# EAGLE board BPB_FM1 (EAGLE 9.6.2), part 1 of 2
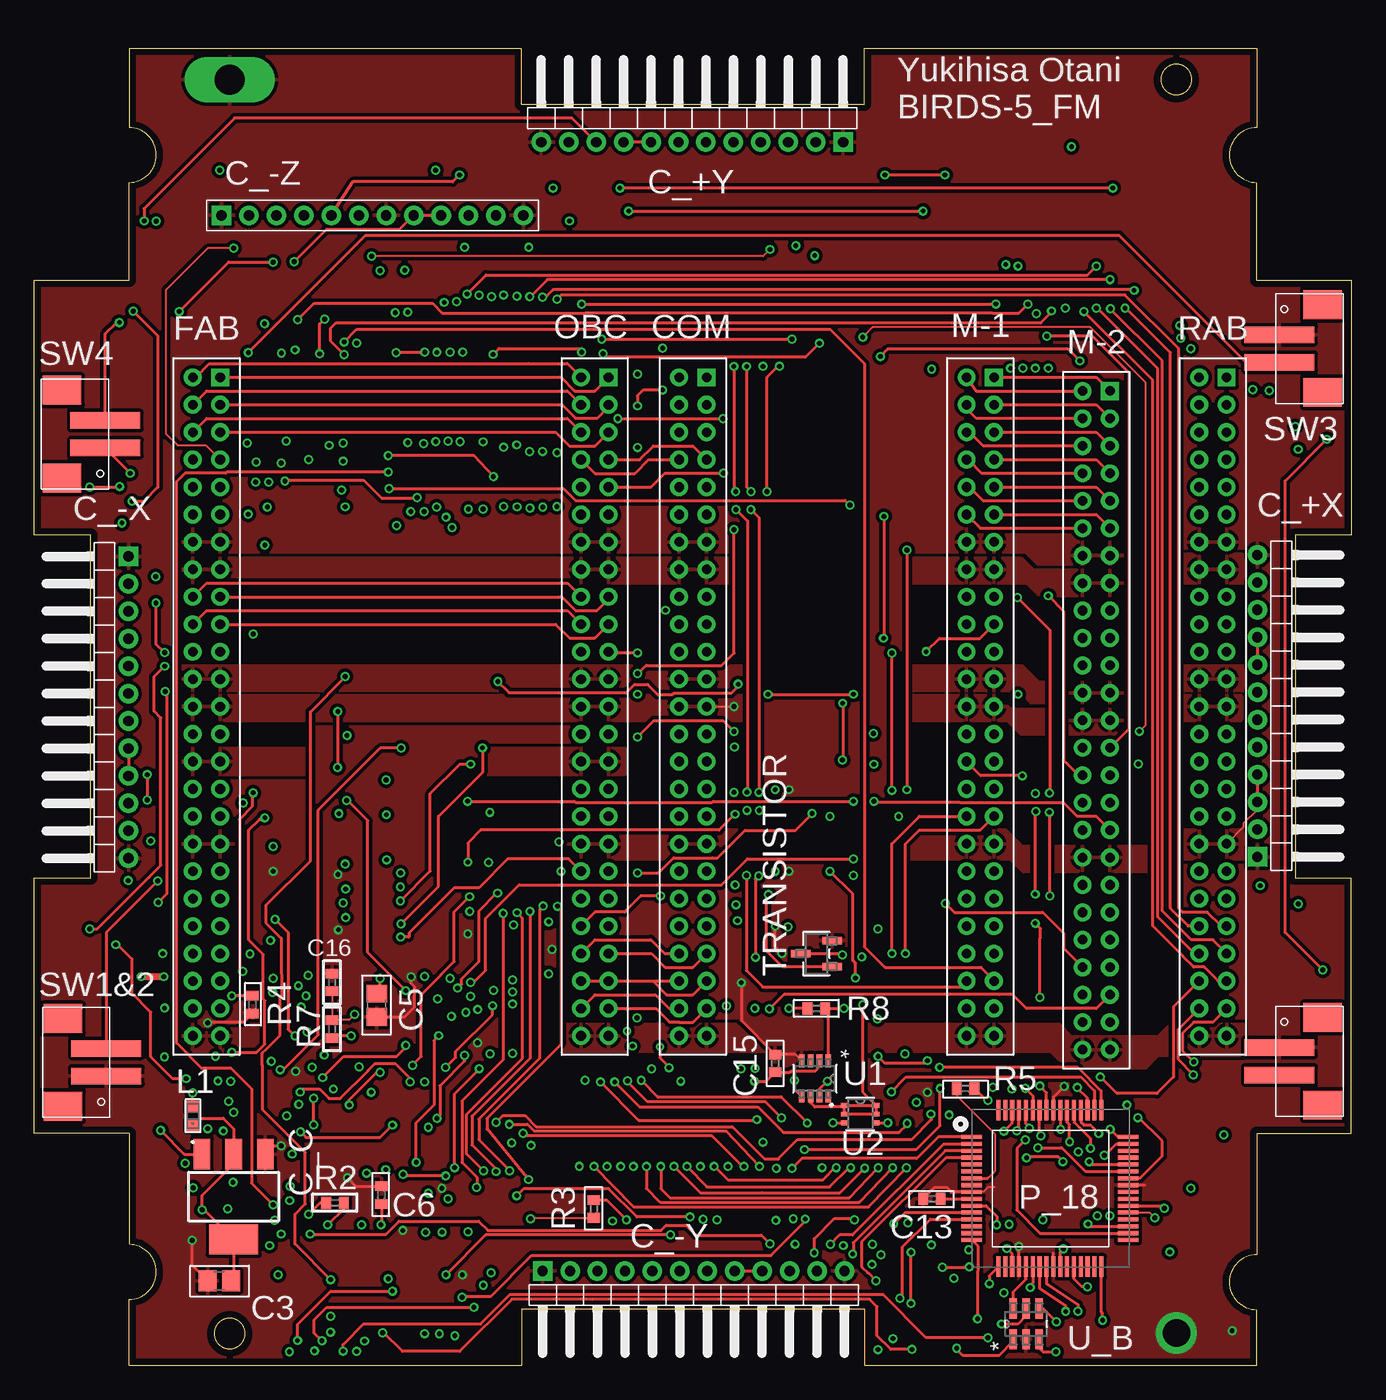
[diagram p2: board, top side]
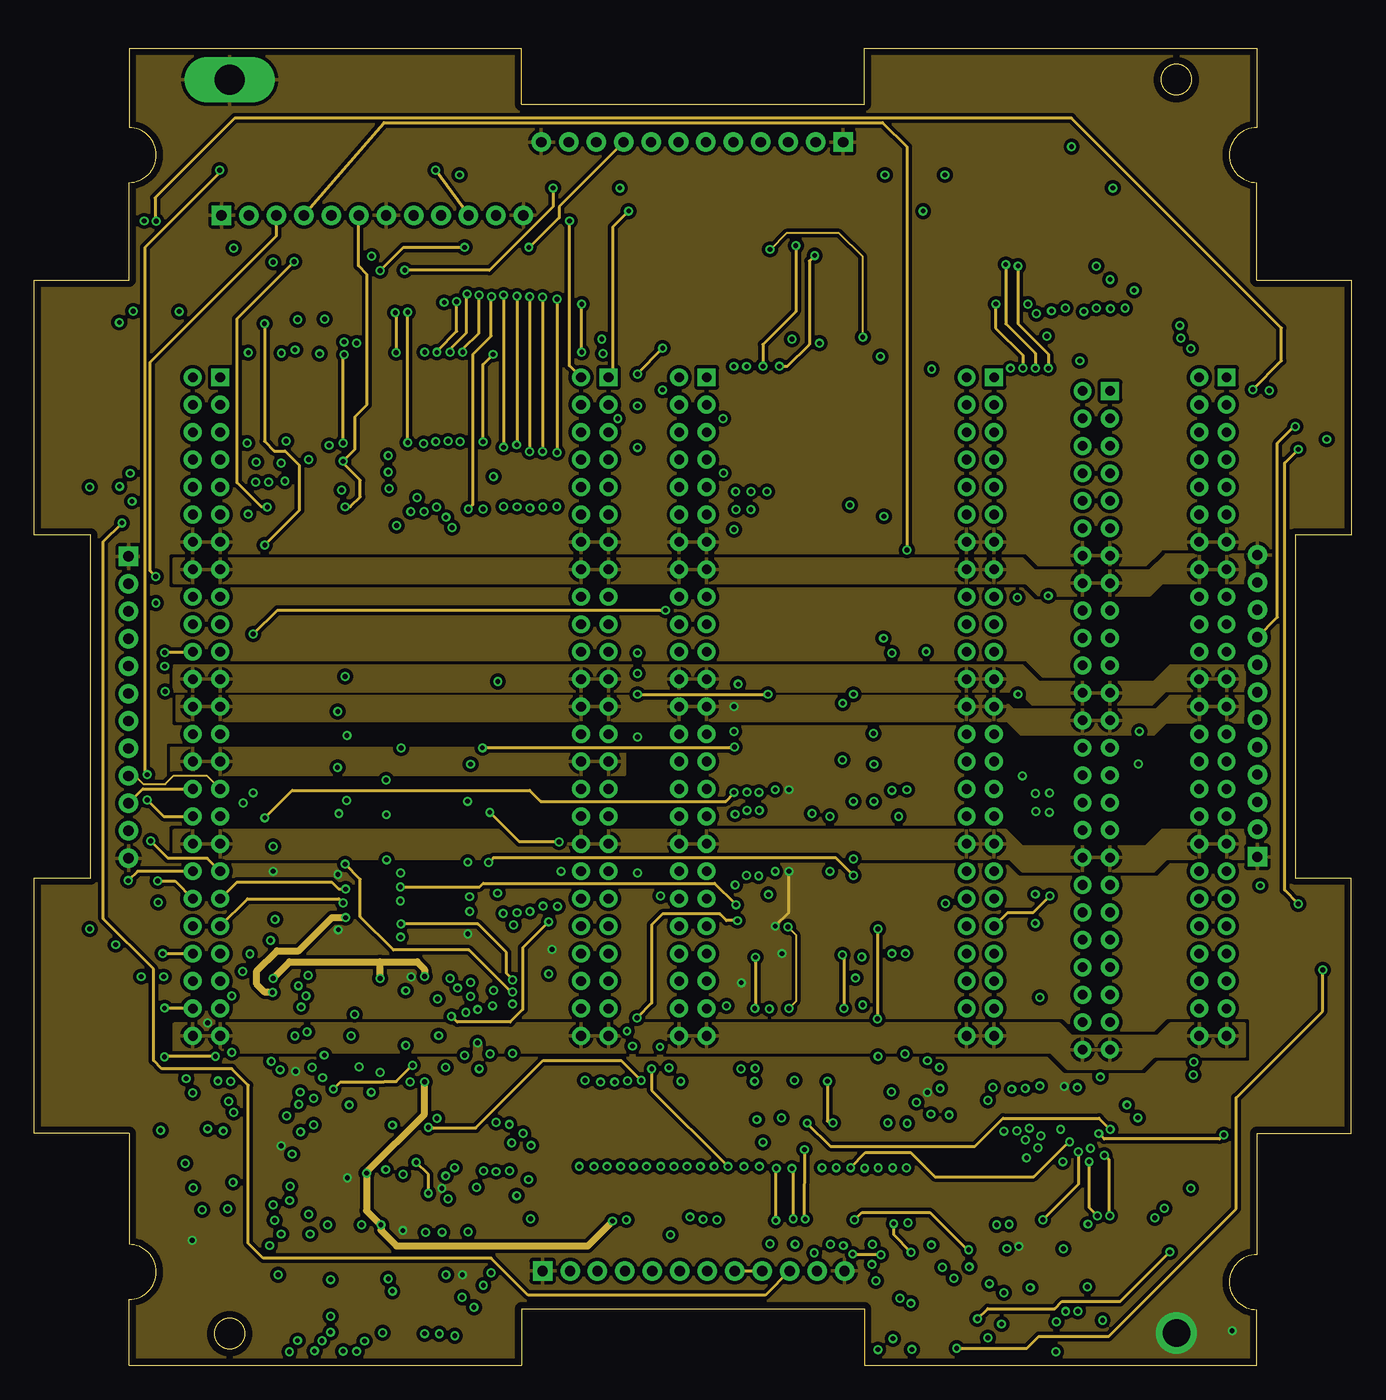
[diagram p3: board, inner layer Power1]
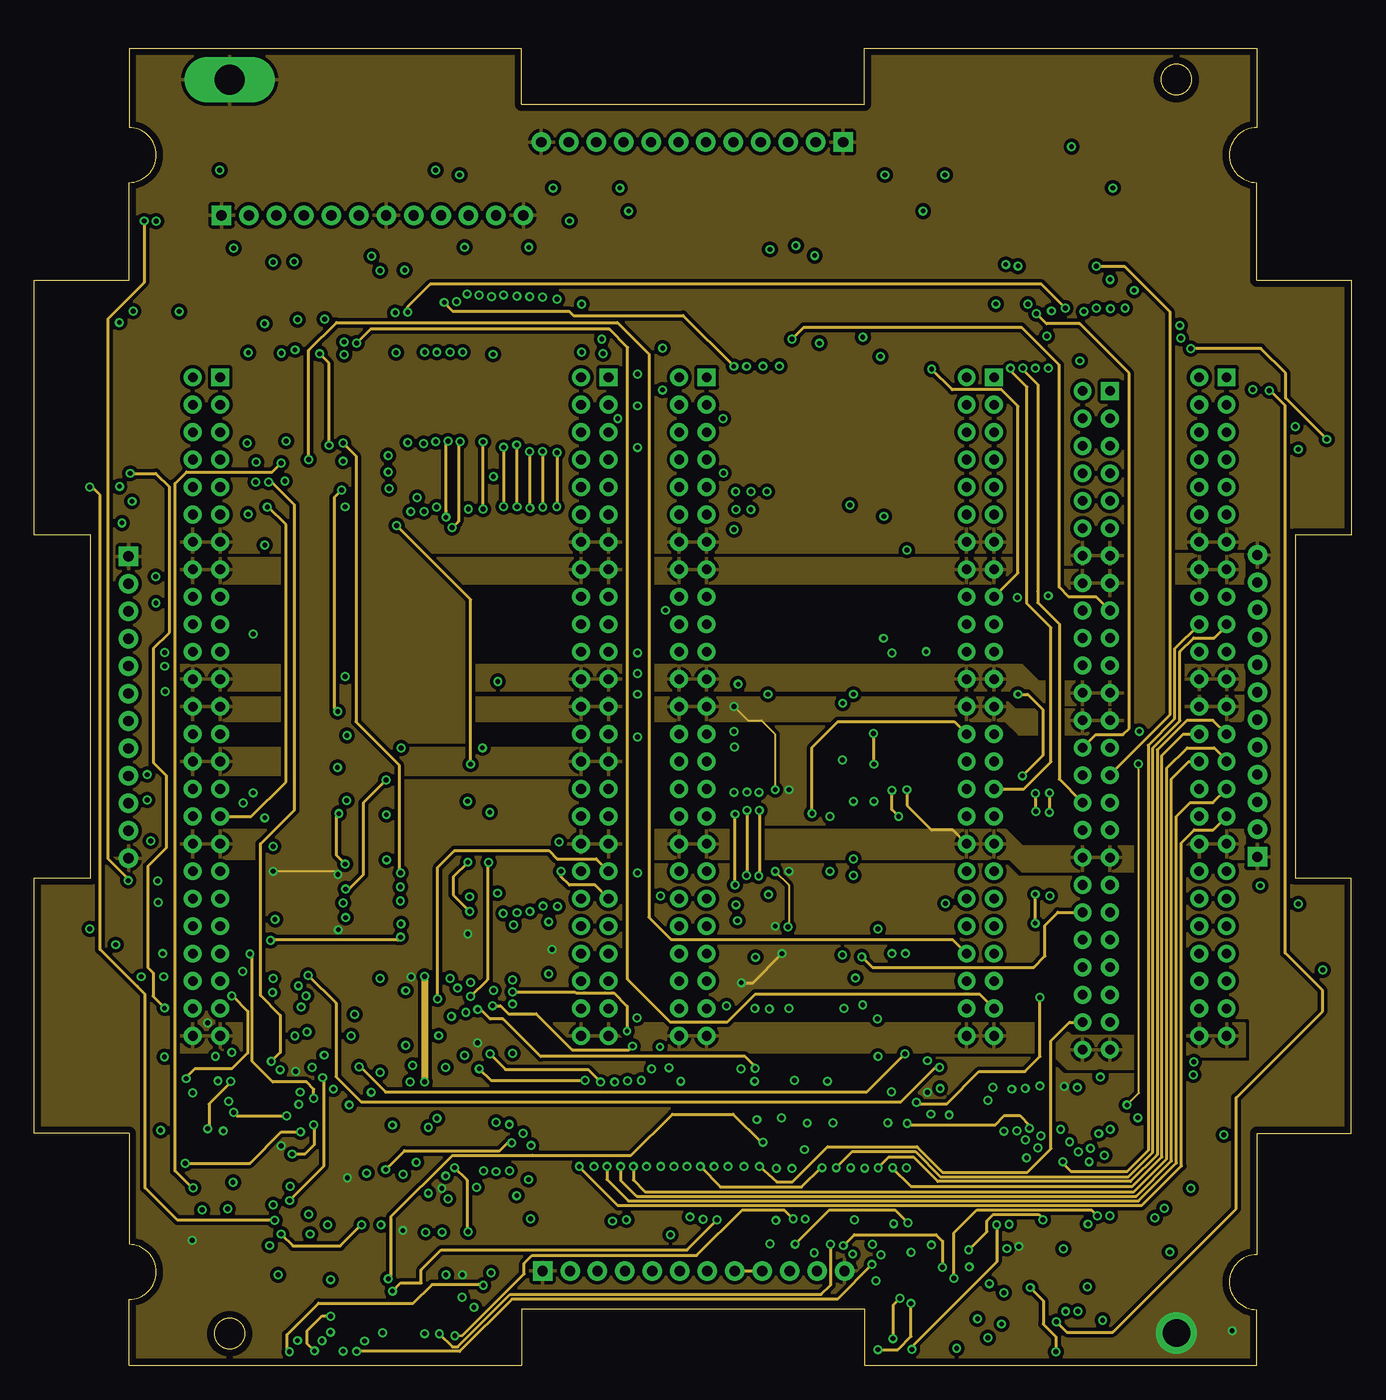
[diagram p4: board, inner layer Route3]
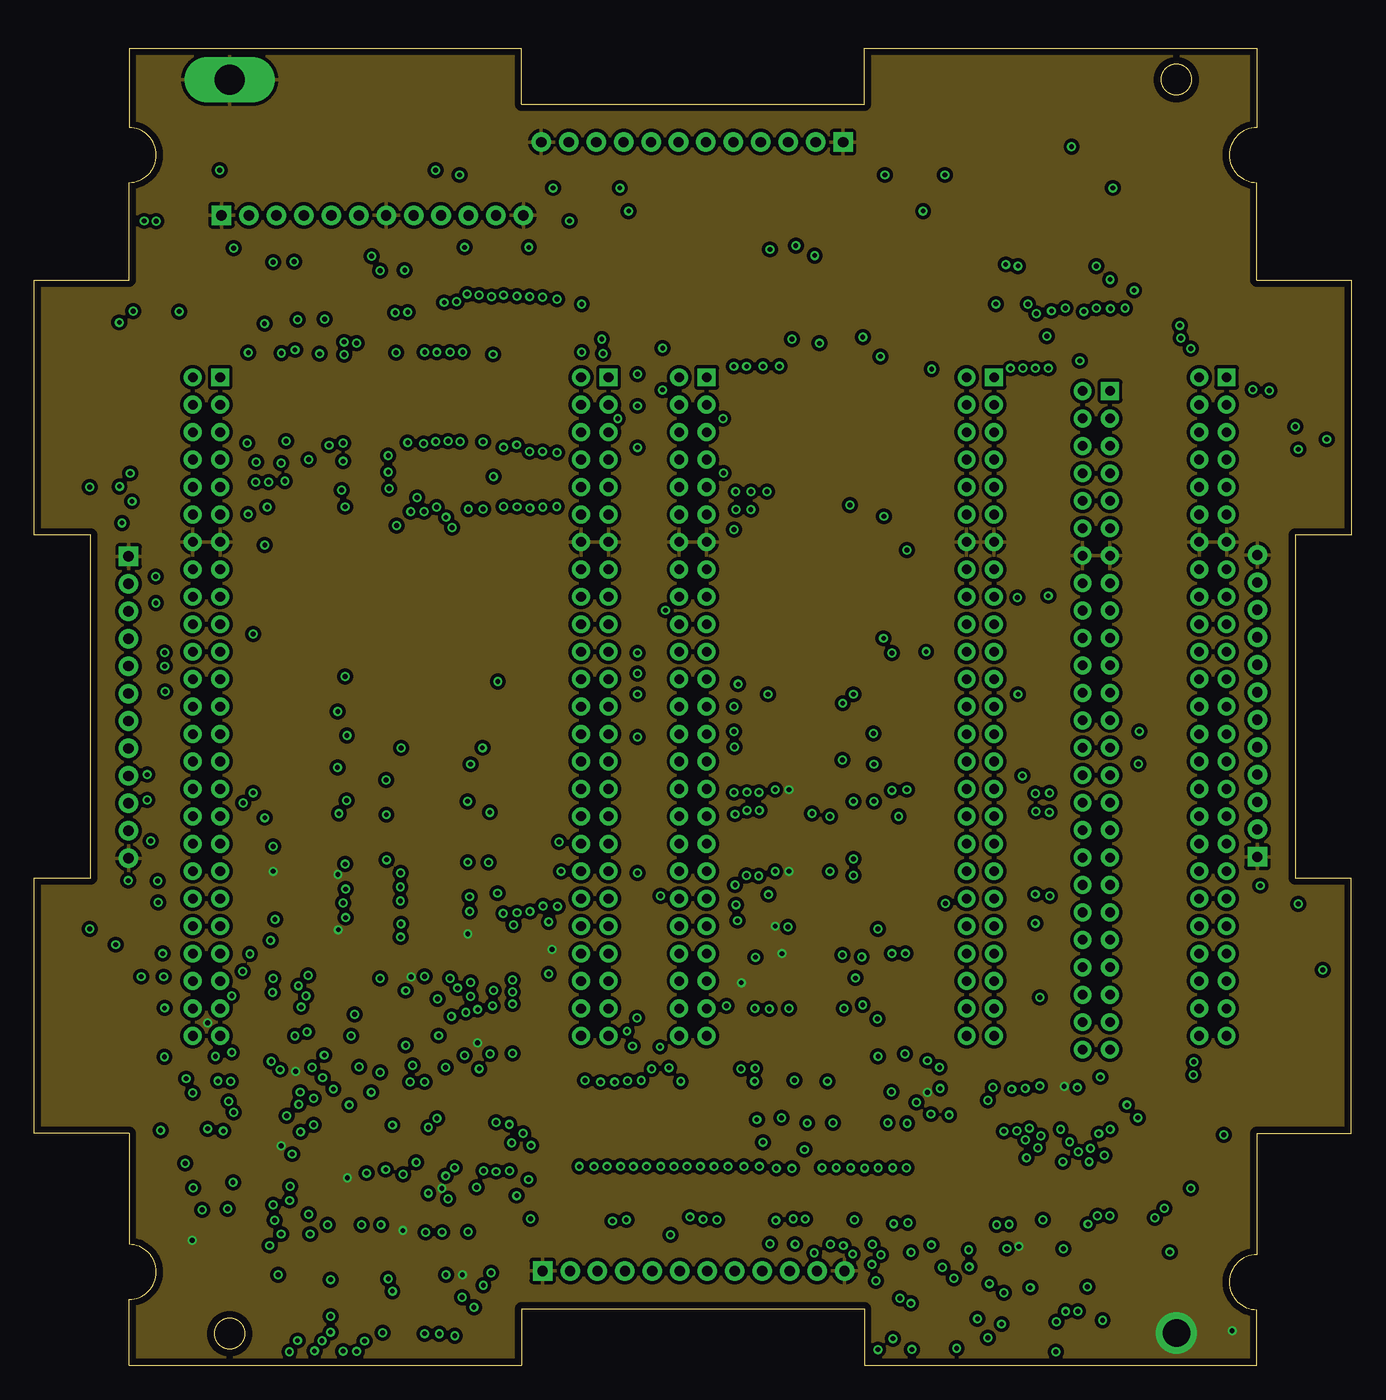
[diagram p5: board, inner layer Route4]
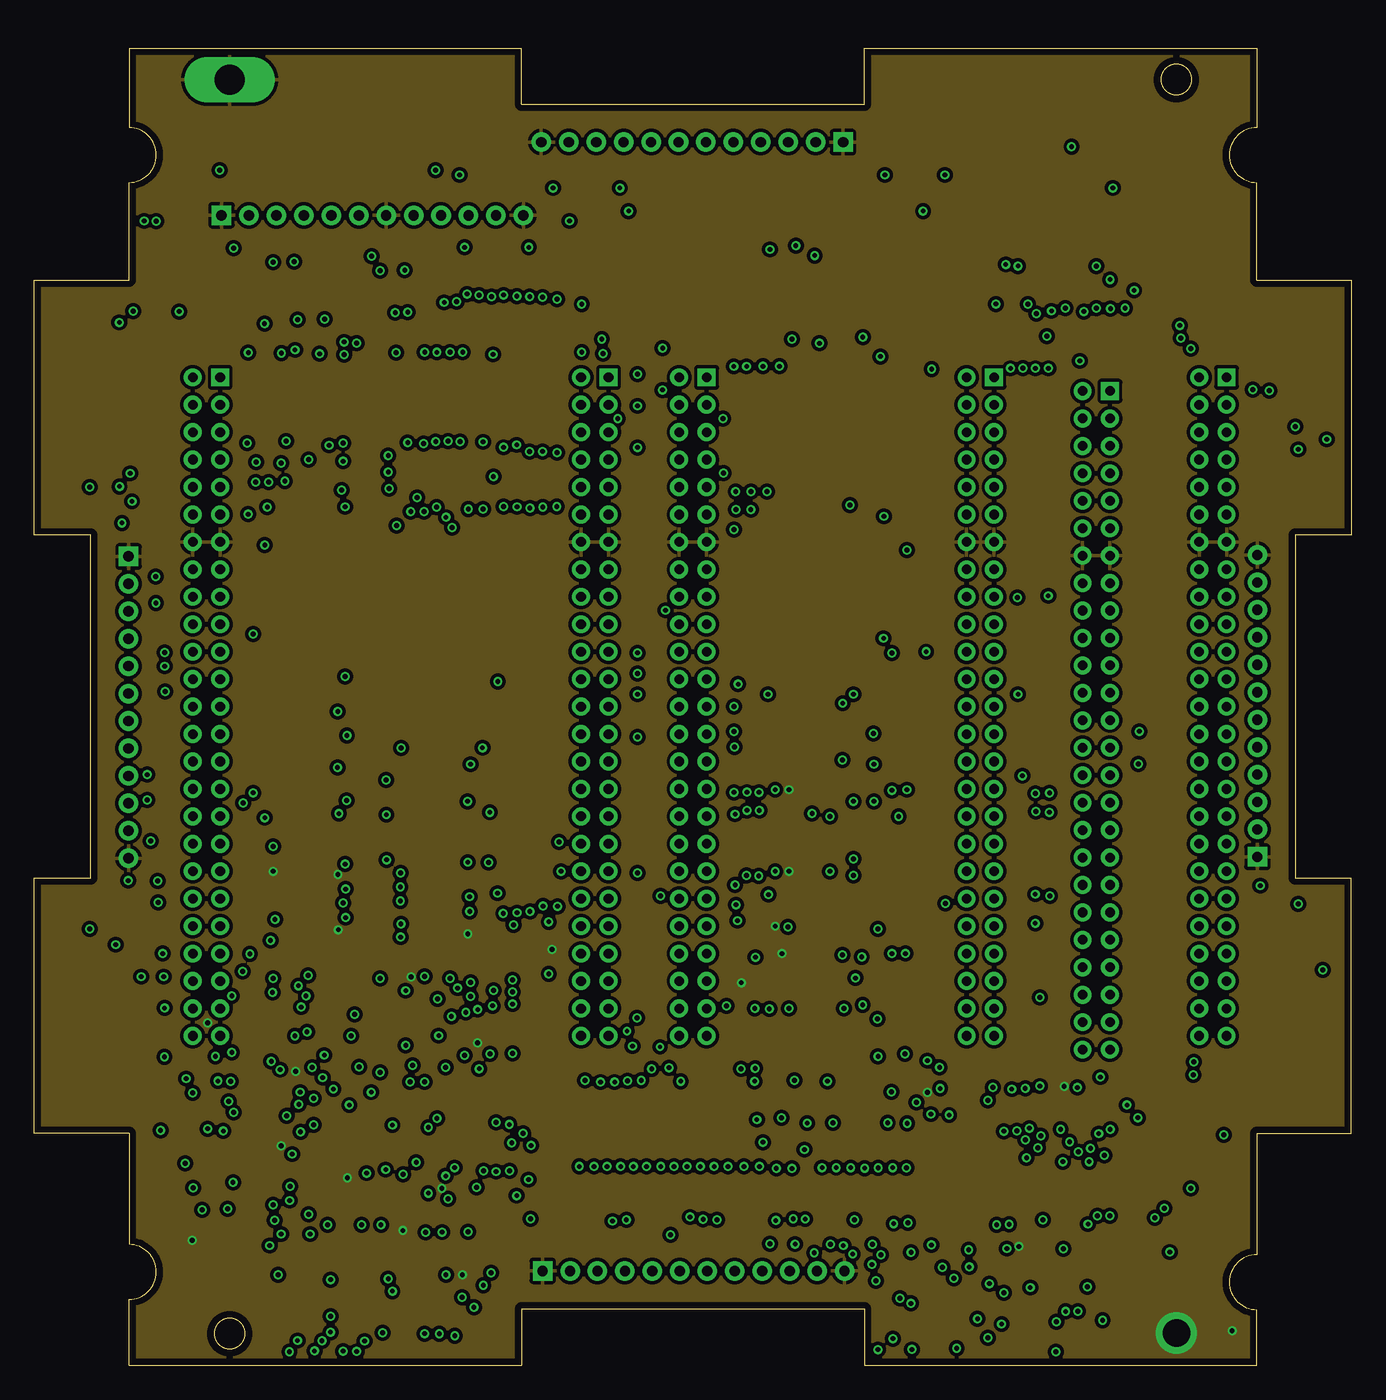
[diagram p6: board, inner layer Route13]
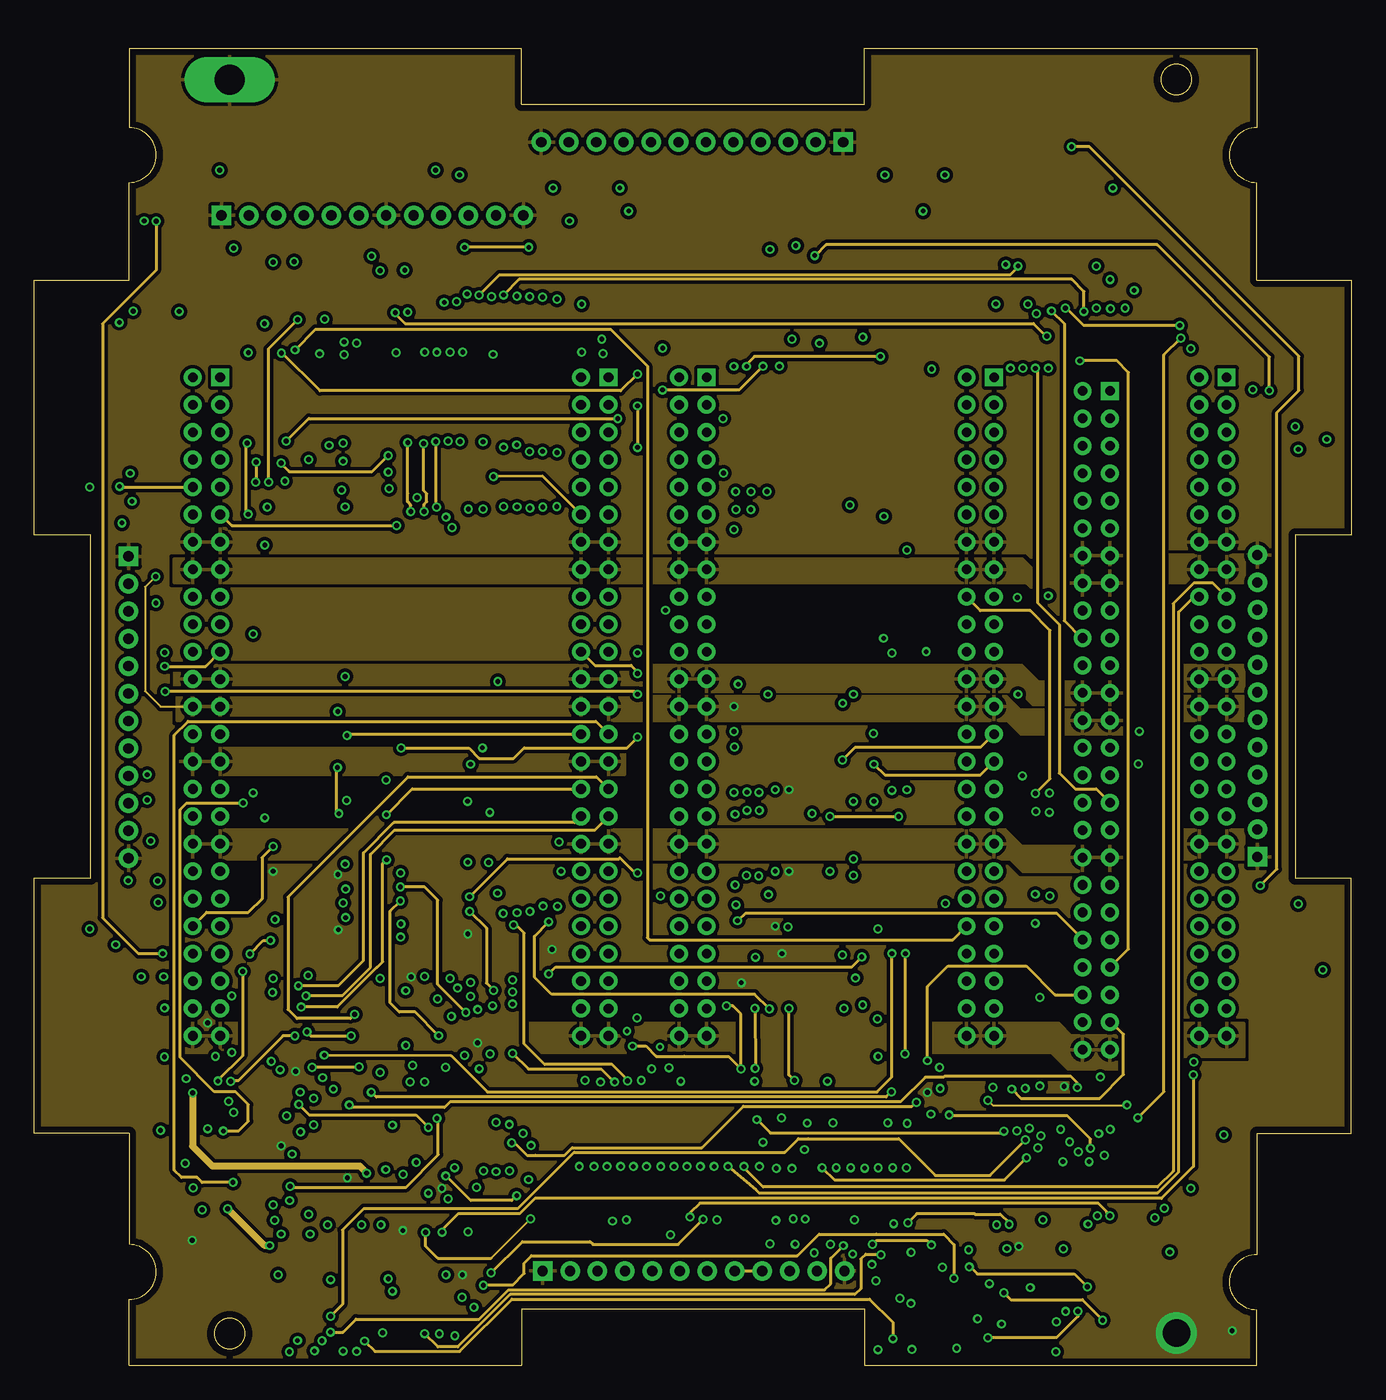
[diagram p7: board, inner layer Route14]
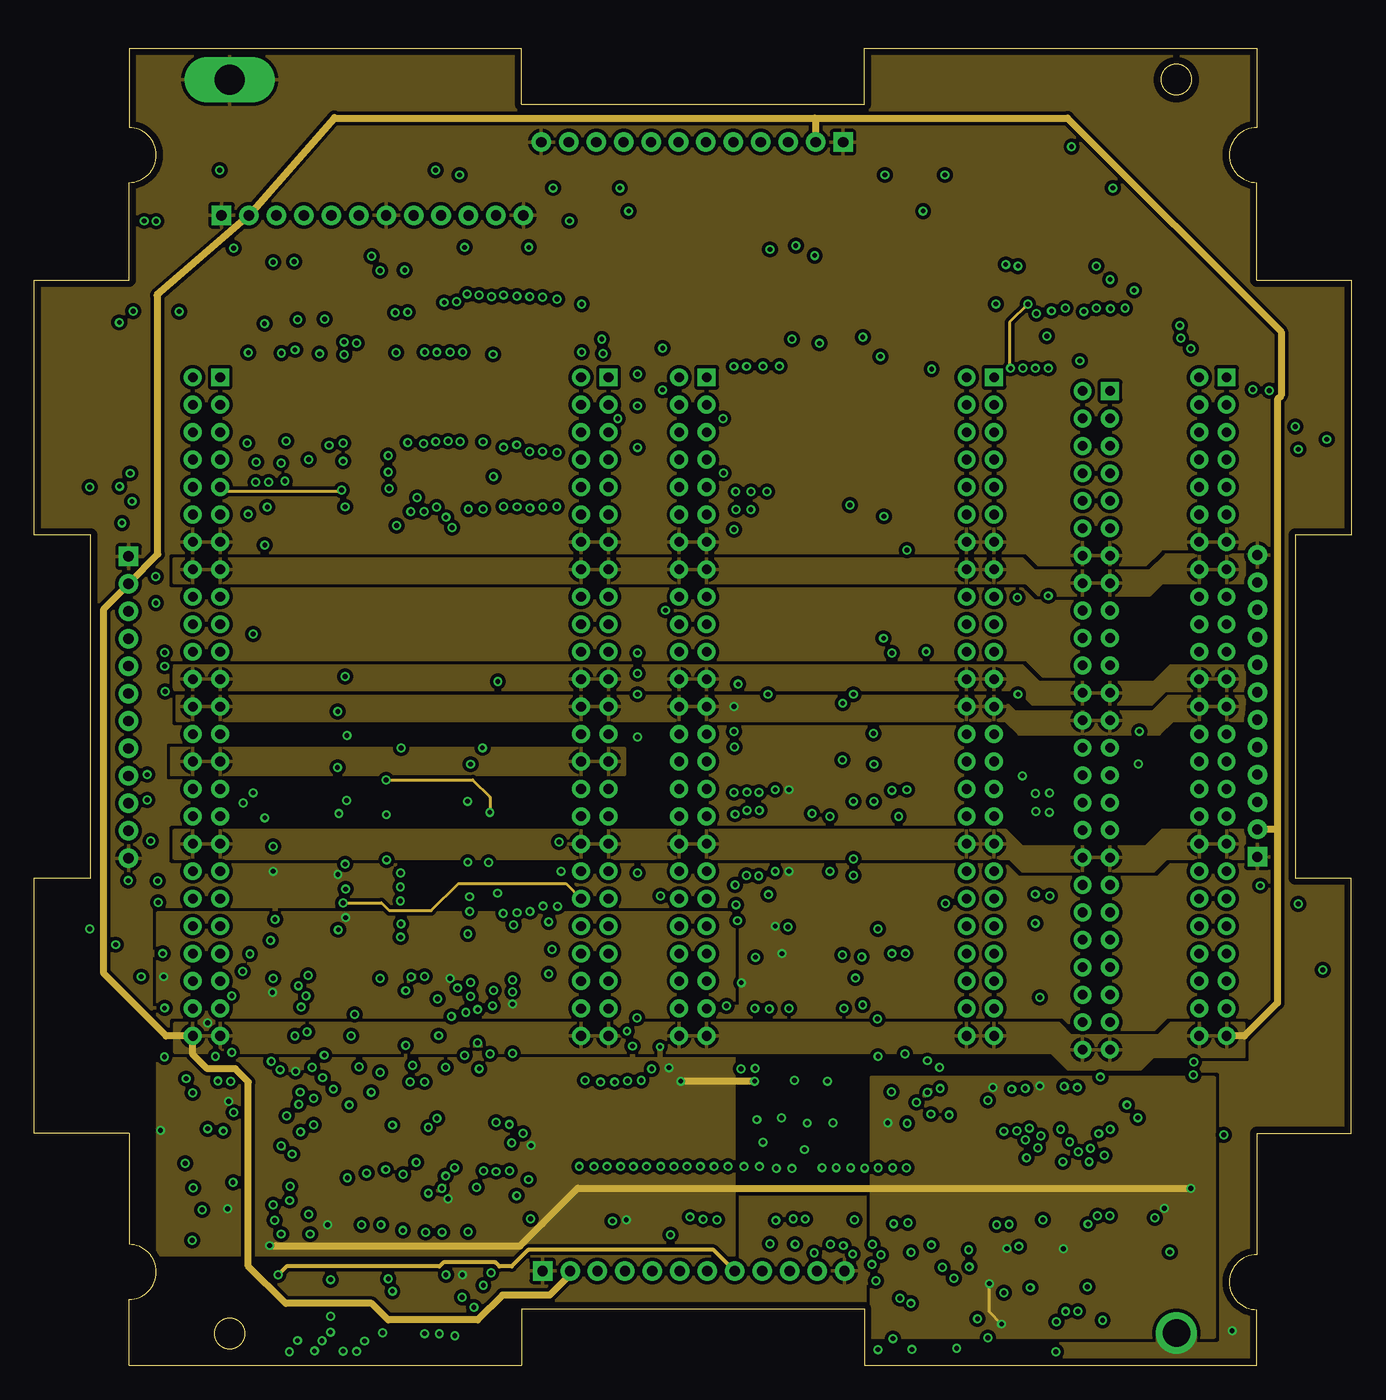
[diagram p8: board, inner layer Power2]
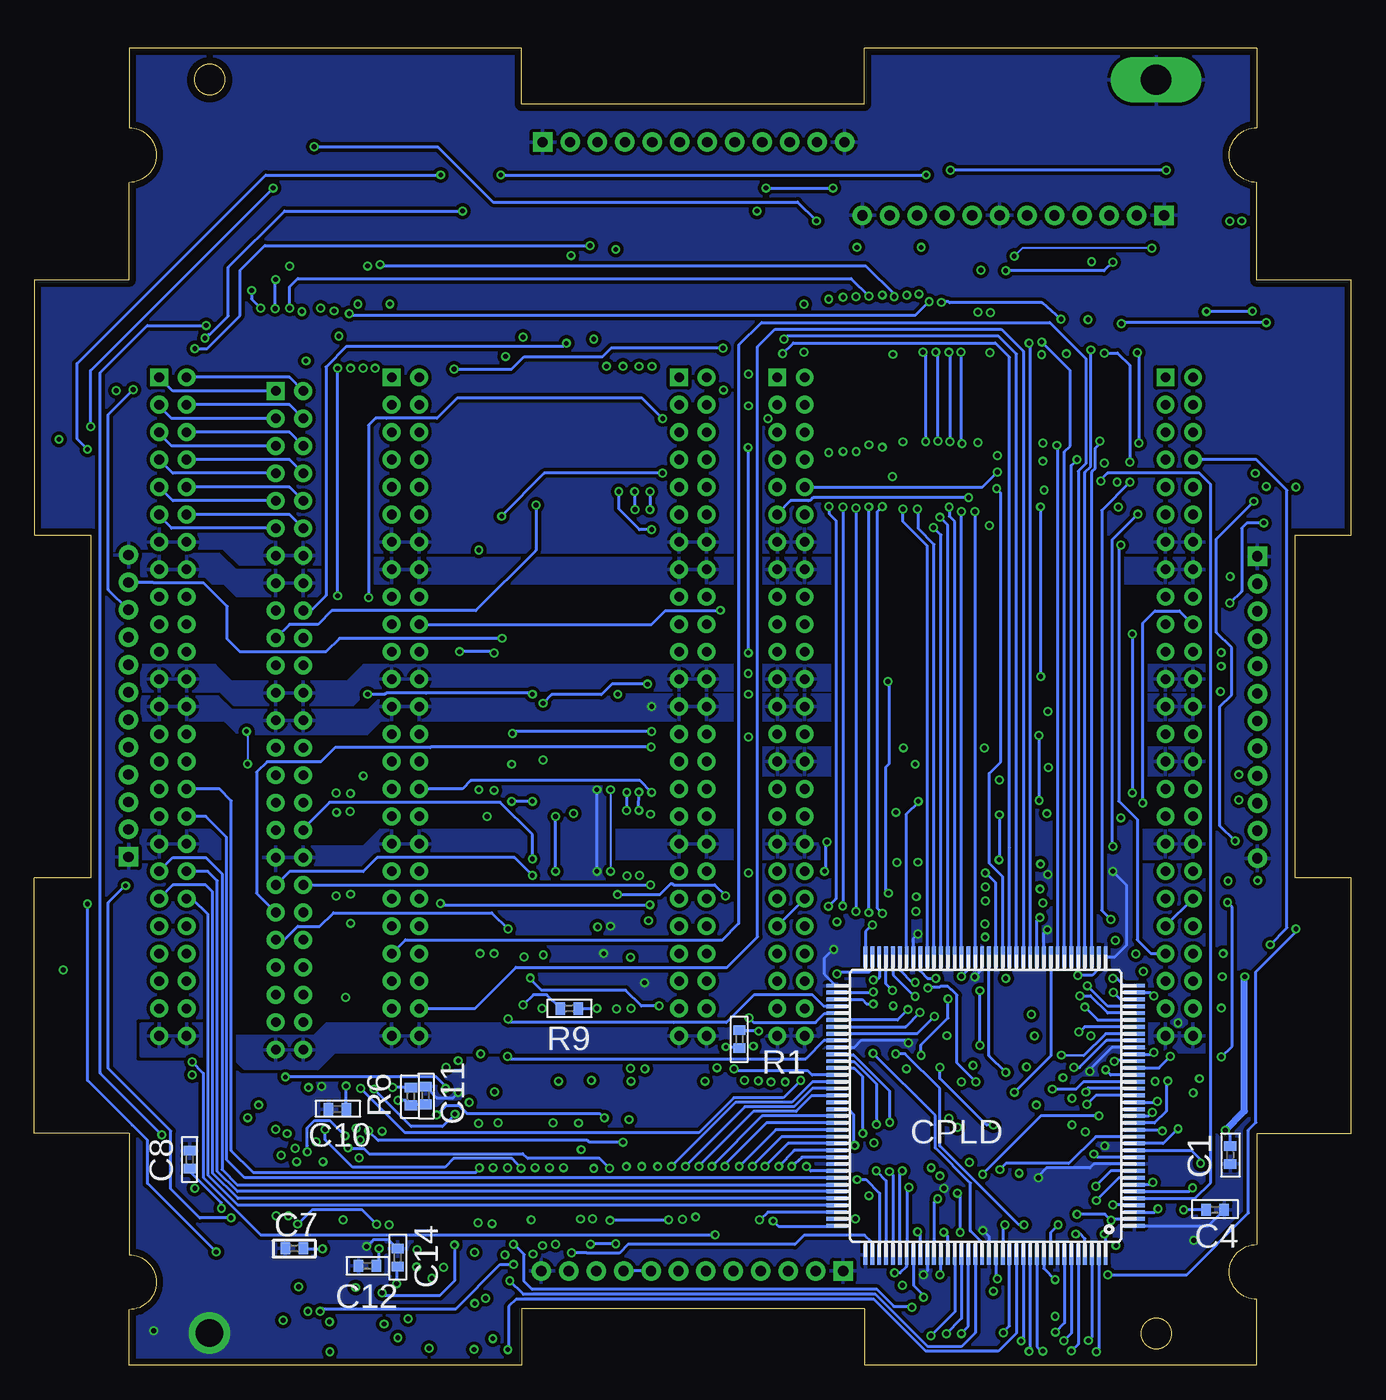
[diagram p9: board, bottom side, seen from below]

Size 96 x 96 mm. Coordinates in mm from the lower left corner, seen from the top.
Outline: 6.9,16.9 0,16.9 0,35.5 4.1,35.5 4.1,60.5 0,60.5 0,79.1 6.9,79.1 6.9,86.2 arc180 6.9,90.2 6.9,96 35.5,96 35.5,91.9 60.5,91.9 60.5,96 89.1,96 89.1,90.2 arc180 89.1,86.2 89.1,79.1 96,79.1 96,60.5 91.9,60.5 91.9,35.5 96,35.5 96,16.9 89.1,16.9 89.1,8.05 arc180 89.1,4.05 89.1,0 60.5,0 60.5,4.1 35.5,4.1 35.5,0 6.9,0 6.9,4.8 arc180 6.9,8.8 6.9,16.9
Outline: circle at 14.23,2.3 radius 1.1
Outline: circle at 83.23,93.71 radius 1.1
Copper layers (1+(2*3)+(14*15)+16): Top 0.018mm / dielectric 0.2mm / Power1 0.035mm / dielectric 0.4mm / Route3 0.035mm / dielectric 0.2mm / Route14 0.035mm / dielectric 0.4mm / Power2 0.035mm / dielectric 0.2mm / Bottom 0.018mm
Design rules "pban_5mil-l6_CURTIS": minimum track width 5mil, minimum drill 0.3mm, track to track 5mil, track to pad 0.229mm, pad to pad 5mil, via to via 5mil, smd to smd 5mil, copper to edge 0.5mm, drill to drill 0.5mm, minimum pad ring 0.15mm, minimum via ring 0.15mm, stop-mask expansion 0.05mm, vias tented up to drill 0.35mm, thermal gap 10mil
Net classes: 3 SUP_UNREG: width 1.27 mm

## Footprints (pad centres in the part's own frame; a part is rotated, then mirrored left to right if it is on the bottom)
C0402 = smd 0.7 x 0.9: 1 -0.65,0; 2 0.65,0
C2012 = smd 1.3 x 1.5: 1 -0.85,0; 2 0.85,0
PIN1X12/90 = drill 0.75 pad 1.422 square: 1 -0.048,-0.063 | drill 0.75 pad 1.422: 2 -2.048,-0.063; 3 -4.048,-0.063; 4 -6.048,-0.063; 5 -8.048,-0.063; 6 -10.048,-0.063; 7 -12.048,-0.063; 8 -14.048,-0.063; 9 -16.048,-0.063; 10 -18.048,-0.063; 11 -20.048,-0.063; 12 -22.048,-0.063
PIN1X12 = drill 0.75 pad 1.422 square: 1 -0.048,-0.063 | drill 0.75 pad 1.422: 2 -2.048,-0.063; 3 -4.048,-0.063; 4 -6.048,-0.063; 5 -8.048,-0.063; 6 -10.048,-0.063; 7 -12.048,-0.063; 8 -14.048,-0.063; 9 -16.048,-0.063; 10 -18.048,-0.063; 11 -20.048,-0.063; 12 -22.048,-0.063
SOT223 = smd 1.219 x 2.235: 1 -2.311,-3.099; 2 0,-3.099; 3 2.311,-3.099 | smd 3.6 x 2.2: 4 0,3.099
SHDR50W60P200_2X25_5000X400X44_TR = drill 0.7 pad 1.3 square: P$1 0,2 | drill 0.7 pad 1.3: P$2 0,0; P$3 2,2; P$4 2,0; P$5 4,2; P$6 4,0; P$7 6,2; P$8 6,0; P$9 8,2; P$10 8,0; P$11 10,2; P$12 10,0; P$13 12,2; P$14 12,0; P$15 14,2; P$16 14,0; P$17 16,2; P$18 16,0; P$19 18,2; P$20 18,0; P$21 20,2; P$22 20,0; P$23 22,2; P$24 22,0; P$25 24,2; P$26 24,0; P$27 26,2; P$28 26,0; P$29 28,2; P$30 28,0; P$31 30,2; P$32 30,0; P$33 32,2; P$34 32,0; P$35 34,2; P$36 34,0; P$37 36,2; P$38 36,0; P$39 38,2; P$40 38,0; P$41 40,2; P$42 40,0; P$43 42,2; P$44 42,0; P$45 44,2; P$46 44,0; P$47 46,2; P$48 46,0; P$49 48,2; P$50 48,0
TQFP144 = smd 1.5 x 0.285: 1 -10.85,8.75; 2 -10.85,8.25; 3 -10.85,7.75; 4 -10.85,7.25; 5 -10.85,6.75; 6 -10.85,6.25; 7 -10.85,5.75; 8 -10.85,5.25; 9 -10.85,4.75; 10 -10.85,4.25; 11 -10.85,3.75; 12 -10.85,3.25; 13 -10.85,2.75; 14 -10.85,2.25; 15 -10.85,1.75; 16 -10.85,1.25; 17 -10.85,0.75; 18 -10.85,0.25; 19 -10.85,-0.25; 20 -10.85,-0.75; 21 -10.85,-1.25; 22 -10.85,-1.75; 23 -10.85,-2.25; 24 -10.85,-2.75; 25 -10.85,-3.25; 26 -10.85,-3.75; 27 -10.85,-4.25; 28 -10.85,-4.75; 29 -10.85,-5.25; 30 -10.85,-5.75; 31 -10.85,-6.25; 32 -10.85,-6.75; 33 -10.85,-7.25; 34 -10.85,-7.75; 35 -10.85,-8.25; 36 -10.85,-8.75; 73 10.85,-8.75; 74 10.85,-8.25; 75 10.85,-7.75; 76 10.85,-7.25; 77 10.85,-6.75; 78 10.85,-6.25; 79 10.85,-5.75; 80 10.85,-5.25; 81 10.85,-4.75; 82 10.85,-4.25; 83 10.85,-3.75; 84 10.85,-3.25; 85 10.85,-2.75; 86 10.85,-2.25; 87 10.85,-1.75; 88 10.85,-1.25; 89 10.85,-0.75; 90 10.85,-0.25; 91 10.85,0.25; 92 10.85,0.75; 93 10.85,1.25; 94 10.85,1.75; 95 10.85,2.25; 96 10.85,2.75; 97 10.85,3.25; 98 10.85,3.75; 99 10.85,4.25; 100 10.85,4.75; 101 10.85,5.25; 102 10.85,5.75; 103 10.85,6.25; 104 10.85,6.75; 105 10.85,7.25; 106 10.85,7.75; 107 10.85,8.25; 108 10.85,8.75 | smd 0.285 x 1.5: 37 -8.75,-10.85; 38 -8.25,-10.85; 39 -7.75,-10.85; 40 -7.25,-10.85; 41 -6.75,-10.85; 42 -6.25,-10.85; 43 -5.75,-10.85; 44 -5.25,-10.85; 45 -4.75,-10.85; 46 -4.25,-10.85; 47 -3.75,-10.85; 48 -3.25,-10.85; 49 -2.75,-10.85; 50 -2.25,-10.85; 51 -1.75,-10.85; 52 -1.25,-10.85; 53 -0.75,-10.85; 54 -0.25,-10.85; 55 0.25,-10.85; 56 0.75,-10.85; 57 1.25,-10.85; 58 1.75,-10.85; 59 2.25,-10.85; 60 2.75,-10.85; 61 3.25,-10.85; 62 3.75,-10.85; 63 4.25,-10.85; 64 4.75,-10.85; 65 5.25,-10.85; 66 5.75,-10.85; 67 6.25,-10.85; 68 6.75,-10.85; 69 7.25,-10.85; 70 7.75,-10.85; 71 8.25,-10.85; 72 8.75,-10.85; 109 8.75,10.85; 110 8.25,10.85; 111 7.75,10.85; 112 7.25,10.85; 113 6.75,10.85; 114 6.25,10.85; 115 5.75,10.85; 116 5.25,10.85; 117 4.75,10.85; 118 4.25,10.85; 119 3.75,10.85; 120 3.25,10.85; 121 2.75,10.85; 122 2.25,10.85; 123 1.75,10.85; 124 1.25,10.85; 125 0.75,10.85; 126 0.25,10.85; 127 -0.25,10.85; 128 -0.75,10.85; 129 -1.25,10.85; 130 -1.75,10.85; 131 -2.25,10.85; 132 -2.75,10.85; 133 -3.25,10.85; 134 -3.75,10.85; 135 -4.25,10.85; 136 -4.75,10.85; 137 -5.25,10.85; 138 -5.75,10.85; 139 -6.25,10.85; 140 -6.75,10.85; 141 -7.25,10.85; 142 -7.75,10.85; 143 -8.25,10.85; 144 -8.75,10.85
TURO_COLLECTION_IND_BLM18_0603 = smd 0.813 x 0.94: 1 -0.673,0; 2 0.673,0
PIC18F67J9_SMA_LEAD = smd 1.5 x 0.3: 1 0,0; 2 0,-0.5; 3 0,-1; 4 0,-1.5; 5 0,-2; 6 0,-2.5; 7 0,-3; 8 0,-3.5; 9 0,-4; 10 0,-4.5; 11 0,-5; 12 0,-5.5; 13 0,-6; 14 0,-6.5; 15 0,-7; 16 0,-7.5; 33 11.4,-7.5; 34 11.4,-7; 35 11.4,-6.5; 36 11.4,-6; 37 11.4,-5.5; 38 11.4,-5; 39 11.4,-4.5; 40 11.4,-4; 41 11.4,-3.5; 42 11.4,-3; 43 11.4,-2.5; 44 11.4,-2; 45 11.4,-1.5; 46 11.4,-1; 47 11.4,-0.5; 48 11.4,0 | smd 0.3 x 1.5: 17 1.95,-9.45; 18 2.45,-9.45; 19 2.95,-9.45; 20 3.45,-9.45; 21 3.95,-9.45; 22 4.45,-9.45; 23 4.95,-9.45; 24 5.45,-9.45; 25 5.95,-9.45; 26 6.45,-9.45; 27 6.95,-9.45; 28 7.45,-9.45; 29 7.95,-9.45; 30 8.45,-9.45; 31 8.95,-9.45; 32 9.45,-9.45; 49 9.45,1.95; 50 8.95,1.95; 51 8.45,1.95; 52 7.95,1.95; 53 7.45,1.95; 54 6.95,1.95; 55 6.45,1.95; 56 5.95,1.95; 57 5.45,1.95; 58 4.95,1.95; 59 4.45,1.95; 60 3.95,1.95; 61 3.45,1.95; 62 2.95,1.95; 63 2.45,1.95; 64 1.95,1.95
R0402 = smd 0.7 x 0.9: 1 -0.65,0; 2 0.65,0
MOLEX-CONN-2-BIRDS = smd 1.2 x 5.1: 1 2.6,2.55; 2 0.6,2.55 | smd 2.1 x 2.8: P$3 -1.6,-0.6; P$4 4.8,-0.6
TRANS_DTA113TKAT_ROM = smd 0.559 x 1.422: 1 -0.95,-1.143; 2 0.95,-1.143; 3 0,1.143
TSOT-23_TS8_LIT = smd 0.876 x 0.406: 1 -1.314,0.975; 2 -1.314,0.325; 3 -1.314,-0.325; 4 -1.314,-0.975; 5 1.314,-0.975; 6 1.314,-0.325; 7 1.314,0.325; 8 1.314,0.975
SON_E85L,F_TOS = smd 0.508 x 0.356: 1 -1.156,0.65; 2 -1.156,0; 3 -1.156,-0.65; 4 1.156,-0.65; 5 1.156,0; 6 1.156,0.65
GND_PAD = drill 2.2 pad 3.3 long: GND_PAD 0,0
DBV6 = smd 1.473 x 0.559: 1 -1.118,0.95; 2 -1.118,0; 3 -1.118,-0.95; 4 1.118,-0.95; 5 1.118,0; 6 1.118,0.95

## Placement (x,y rotation side)
C1  0.1uF  [C0402]  8.84,15.32 270 bottom
C3  22uF  [C2012]  13.49,6.15 180 top
C4  0.1uF  [C0402]  9.94,11.32 0 bottom
C5  4.7uF  [C2012]  24.96,26.23 270 top
C6  0.1uF  [C0402]  25.3,12.4 90 top
C7  0.1uF  [C0402]  77.05,8.52 180 bottom
C8  0.1uF  [C0402]  84.68,14.99 90 bottom
C10  0.1uF  [C0402]  73.91,18.66 180 bottom
C11  0.1uF  [C0402]  67.48,19.66 90 bottom
C12  0.1uF  [C0402]  71.73,7.24 0 bottom
C13  10uF  [C0402]  65.42,12.13 180 top
C14  0.1uF  [C0402]  69.52,7.84 90 bottom
C15  4.7uF  [C0402]  54,22 270 top
C16  100pF  [C0402]  21.7,27.9 90 top
C_+X  PSR-210154-12  [PIN1X12/90]  89.2,37 270 top
C_+Y  PSR-210154-12  [PIN1X12/90]  59,89.2 0 top
C_-X  PSR-210154-12  [PIN1X12/90]  6.8,59 90 top
C_-Y  PSR-210154-12  [PIN1X12/90]  37,6.8 180 top
C_-Z  PSS-210204-12  [PIN1X12]  13.6,83.74 180 top
C_C  NCV1117ST18T3G  [SOT223]  14.53,12.28 180 top
COM  A3C-50DA-2DSA(71)_TUROA3C-50A-2DSA  [SHDR50W60P200_2X25_5000X400X44_TR]  47,72 270 top
CPLD  LC4256ZE_XXTN144  [TQFP144]  26.67,18.91 180 bottom
FAB  A3C-50DA-2DSA(71)_TUROA3C-50A-2DSA  [SHDR50W60P200_2X25_5000X400X44_TR]  11.55,72 270 top
L1  TURO_COLLECTION_BLM18AG601SN1D  [TURO_COLLECTION_IND_BLM18_0603]  11.55,18.17 90 top
M-1  A3C-50DA-2DSA(71)_TUROA3C-50A-2DSA  [SHDR50W60P200_2X25_5000X400X44_TR]  67.95,72 270 top
M-2  A3C-50DA-2DSA(71)_TUROA3C-50A-2DSA  [SHDR50W60P200_2X25_5000X400X44_TR]  76.4,71 270 top
OBC  A3C-50DA-2DSA(71)_TUROA3C-50A-2DSA  [SHDR50W60P200_2X25_5000X400X44_TR]  39.85,72 270 top
P_18  PIC18F67J94  [PIC18F67J9_SMA_LEAD]  68.32,16.63 0 top
R1  5k6  [R0402]  44.6,23.76 90 bottom
R2  5k6  [R0402]  21.92,11.84 180 top
R3  5k6  [R0402]  40.78,11.39 270 top
R4  5k6  [R0402]  15.9,26.28 270 top
R5  100  [R0402]  67.87,20.16 0 top
R6  10k  [R0402]  68.56,19.59 90 bottom
R7  100  [R0402]  21.7,24.5 90 top
R8  10k  [R0402]  57,26 180 top
R9  0.15  [R0402]  57,26 180 bottom
RAB  A3C-50DA-2DSA(71)_TUROA3C-50A-2DSA  [SHDR50W60P200_2X25_5000X400X44_TR]  84.9,72 270 top
SW0  MOLEX-CONN-2-0554600272  [MOLEX-CONN-2-BIRDS]  93.3,20.55 90 top
SW1-2  MOLEX-CONN-2-0554600272  [MOLEX-CONN-2-BIRDS]  2.7,23.68 270 top
SW3  MOLEX-CONN-2-0554600272  [MOLEX-CONN-2-BIRDS]  93.3,72.5 90 top
SW4  MOLEX-CONN-2-0554600272  [MOLEX-CONN-2-BIRDS]  2.62,69.46 270 top
TRANSISTOR  DTC144EKAT146  [TRANS_DTA113TKAT_ROM]  57,30 90 top
U1  LTC4361CTS8-2TRMPBF  [TSOT-23_TS8_LIT]  56.9,20.9 270 top
U2  SSM6K411TU(TE85L,F  [SON_E85L,F_TOS]  60.2,18.3 0 top
U$1  GND_PAD  [GND_PAD]  14.24,93.7 0 top
U_B  SN74LVC2G34DBVR  [DBV6]  72.28,3.01 90 top

## Tracks (layer width: path | path; a pad name or v marks a point on that pad's centre or on a via)
ANALOG(OBC-COM7)
  Top 0.203: COM.P$47 48,25 47,25 46.98,25.02 46.29,25.02 45.31,26 OBC.P$47
ANALOG(OBC-COM8)
  Top 0.203: OBC.P$48 40.85,27 45.26,27 46.26,26 COM.P$48
ANALOG_DLP  (via drill 0.35)
  Top 0.203: v68.75,3.38 68.75,6.84 68.8,6.89 68.8,8.65 P_18.16 | v66.38,86.75 v62,86.75 | v31,86.75 30.5,86.25 23.2,86.25 C_-Z.5
  Power1 0.203: v68.75,3.38 69.5,4.12 74.37,4.12 74.89,4.65 79.15,4.65 v82.75,8.25 | v92.12,33.62 91.12,34.62 91.12,65.75 v92.12,66.75
  Bottom 0.203: v82.75,8.25 87.75,13.25 87.75,16.4 88.85,17.5 88.88,17.5 92.12,20.75 v92.12,33.62 | v92.12,66.75 92.88,67.5 92.88,73 79.12,86.75 v66.38,86.75 | v62,86.75 v31,86.75
BATTERY_GND  (via drill 0.35)
  Top 0.203: SW4.1 7,65.03 v7,65
  Power1 0.203: v9.49,26.03 11.52,26.03 FAB.P$48
  Route3 0.203: v9.49,26.03 v9.5,26.04 8.66,26.88 8.66,28.6 8.28,28.98 8.28,36.36 9.62,37.7 9.62,42.98 8.68,43.92 8.68,52.23 9.85,53.4 9.85,64 8.85,65 v7,65
BPB_POWER  (via drill 0.3, 0.35)
  Top 0.203: v70.5,3 71.69,3 72.28,3.59 U_B.5 | P_18.17 69.6,6.51 v69.6,5.94 | P_18.19 71.27,8.11 v70.88,8.5 | P_18.26 74.77,8.25 v75,8.48 | P_18.38 82.17,11.63 v82.36,11.44 | P_18.57 73.77,19.85 v73.28,20.34 | U2.4 61.38,17.67 v62.2,17.67 | U1.2 57.11,22.1 57.11,21.64 56.91,21.45 55.15,21.45 55.06,21.35 C15.2 53.3,20.65 52.5,20.65 v52.5,20.7 | v45.6,23.2 45.6,22.4 46.25,21.75 v46.25,21.68 | R3.1 41.72,12.04 v43.15,10.61 | v9.2,17.12 10.94,15.38 C_C.3 | R2.1 22.57,11.41 v21.38,10.22
  Top 0.508: v7.78,28.32 v9.42,28.32
  Power1 0.508: v17.36,27.18 16.8,27.18 16.22,27.76 16.22,28.74 17.68,30.2 19.28,30.2 21.7,32.62 v22.7,32.62
  Route14 0.508: v14.1,11.4 16.76,8.74 v17.16,8.72
  Power2 0.203: v70.5,3 69.6,3.9 v69.6,5.94
  Power2 0.508: v84.3,12.9 39.6,12.9 37.02,10.32 37.02,10.3 35.41,8.7 20.46,8.7 20.45,8.7 17.64,8.7 17.62,8.72 v17.16,8.72 | v52.5,20.7 v47.11,20.7
  Bottom 0.203: C1.1 8.84,16.76 v9.2,17.12 | v30.16,12.14 30.42,11.88 CPLD.119 | CPLD.136 21.92,9.68 v21.38,10.22 | CPLD.3 14.34,11.16 v14.1,11.4 | CPLD.19 14.22,19.16 v14.16,19.22 | v17.36,27.18 16.84,26.66 CPLD.34 | CPLD.47 22.92,32.4 v22.7,32.62 | CPLD.64 31.42,28.72 30.9,28.2 v30.3,28.2 | CPLD.75 35.66,26.66 35.34,26.34 34.88,26.34 v34.86,26.32 | CPLD.91 37.49,18.63 36.63,18.63 36.3,18.3 36.3,16.12 v36.19,16.01 v36.2,16.01 | C12.2 70.88,7.44 v70.88,8.5 | C14.1 69.6,7.11 v69.6,5.94 | v82.36,11.44 82.36,11.84 84.77,14.25 C8.1 | C10.1 73.28,18.66 v73.28,20.34 | v43.15,10.61 43.09,10.61 42.54,11.16 CPLD.106 | v45.6,23.2 44.69,23.2 R1.1 | R6.2 69.86,20.24 v69.88,20.25 | C7.1 76.36,8.48 v75,8.48
  Bottom 0.508: v9.2,17.12 7.8,18.52 7.8,28.3 v7.78,28.32
  pour Power2 (isolate 0.254, rank 2): 9,33 51,33 51,8 9,8
  pour Power2 (isolate 0.254): 61,21 86,21 86,2 61,2
CPLD(1)  (via drill 0.35)
  Top 0.203: v25.8,65.1 14.04,65.1 13.96,65.02 10.98,65.02 10.36,64.4 10.36,23.48 12.18,21.66 14.32,21.66 15.84,20.14 15.84,13.26 v17.4,11.7
  Bottom 0.203: OBC.P$10 26.9,64 v25.8,65.1 | CPLD.4 15.85,11.69 16.71,11.69 16.72,11.7 v17.4,11.7
CPLD(2)  (via drill 0.35)
  Top 0.203: v18.26,64.44 18.32,64.5 24,64.5 25.3,63.2 27.88,63.2 v27.9,63.22
  Bottom 0.203: CPLD.5 11.4,12.16 10.26,13.3 10.26,64.2 11.08,65.02 17.78,65.02 18.3,64.5 18.3,64.48 v18.26,64.44 | v27.9,63.22 39.24,63.22 39.44,63.02 39.58,63.02 39.6,63 40.88,63 41.85,62.03 OBC.P$11
CPLD(3)  (via drill 0.35)
  Top 0.203: v33.46,64.76 32.04,66.3 v25.8,66.3
  Route3 0.203: v11.58,12.92 11.5,12.92 10.26,14.16 10.26,64.26 11.1,65.1 17.34,65.1 v18,65.76
  Route14 0.203: OBC.P$12 37.05,64.8 v33.46,64.76 | v25.8,66.3 24.6,65.1 18.61,65.1 18.56,65.15 18.55,65.15 17.97,65.73 v18,65.76
  Bottom 0.203: v11.58,12.92 11.85,12.66 CPLD.6
CPLD(4)  (via drill 0.35)
  Route14 0.203: v14.48,13.32 12.22,13.32 11.86,13.68 10.74,13.68 10.2,14.22 10.2,45.92 11.2,46.92 40.93,46.92 OBC.P$27
  Bottom 0.203: CPLD.7 15.79,13.19 14.61,13.19 v14.48,13.32
CPLD(5)  (via drill 0.35)
  Top 0.203: v21.02,20.96 22.56,22.5 26.4,22.5 27.08,23.18 v27.08,23.3 | v27.08,27.3 24.3,30.08 24.3,39.7 22.76,41.24 v22.76,41.15
  Route3 0.203: v21.02,20.96 21.08,20.9 21.08,14.48 v18.6,12
  Route14 0.203: v22.78,45.9 22.88,46 OBC.P$28
  Bottom 0.203: CPLD.8 16.94,13.66 v18.6,12 | v27.08,23.3 27.08,27.22 27,27.3 v27.08,27.3 | v22.76,41.15 22.76,45.86 22.8,45.9 v22.78,45.9
CPLD(6)  (via drill 0.35)
  Top 0.203: v29.34,18 29.56,18.22 29.56,20.36 31.36,22.16 v31.36,22.58
  Route3 0.203: v29.4,26.7 29.4,36.28 30.62,37.5 37.5,37.5 38.1,36.9 40.95,36.9 OBC.P$37
  Route14 0.203: v18.64,13.04 18.74,12.94 27.04,12.94 29.44,15.34 29.44,18 v29.34,18
  Bottom 0.203: CPLD.9 17.54,14.16 18.64,13.06 v18.64,13.04 | v31.36,22.58 31.36,23.34 29.4,25.31 v29.4,26.7
CPLD(7)  (via drill 0.35)
  Top 0.203: v20.36,17.52 v20.36,19.44 | v20.36,19.44 20.36,19.68 v20.36,19.45 v20.36,19.44 | OBC.P$38 38.95,36.9 34.5,36.9 32.4,34.8 30.6,34.8 27.3,31.5 27.3,31.2 v26.7,31.2
  Route3 0.203: v20.36,17.52 20.42,17.47 20.42,16.08 19.73,15.39 v18.79,15.39 | v20.36,19.44 20.36,20.12 19.84,20.64 17.38,20.64 15.89,22.13 15.89,29.8 v15.71,29.97 | v26.7,31.2 26.49,30.99 17.25,30.99 v17.21,30.95
  Route14 0.203: v15.71,29.97 16.7,30.95 v17.21,30.95
  Bottom 0.203: CPLD.11 18.56,15.16 v18.79,15.39
CPLD(8)  (via drill 0.35)
  Top 0.203: v19.4,17 19.8,16.6 25.2,16.6 v26.1,17.5 | v29.99,21.71 30.71,22.43 30.71,22.86 33.4,25.55 v33.4,26.2 | v59.85,28.22 59.85,29.3 59.65,29.5 59.65,34.35 v58,36 | v62.5,41.9 v62.5,51.9 | v65,52 65.98,52.98 68.93,52.98 M-1.P$19
  Route3 0.203: v11,14.72 15.72,14.72 18,17 v19.4,17 | v33.4,26.2 33.98,26.2 34.56,25.61 36.59,25.61 39.2,23 43.34,23 v43.6,23.26 | v63,40 62.5,40.5 v62.5,41.9
  Route14 0.203: v43.6,23.26 44.58,23.26 45.32,22.52 47.38,22.52 47.4,22.5 50.6,22.5 v51.5,21.6 51.5,25.6 50.92,26.18 v50.46,26.18 | v58,40 v63,40
  Bottom 0.203: CPLD.12 11.66,15.66 11,15 v11,14.72 | v26.1,17.5 26.6,17.5 30,20.9 v30,21.7 v29.99,21.71 | v50.46,26.18 51.76,26.18 52.9,27.33 59.03,27.33 59.85,28.15 v59.85,28.22 | v58,36 v58,40 | v62.5,51.9 62.6,52 v65,52
CPLD(9)  (via drill 0.35)
  Top 0.203: v17.54,32.5 18.49,31.55 18.49,24.49 18.98,24 v19,24
  Power1 0.203: v45.8,74.12 43.88,72.2 43.84,72.2 43.86,72.22 43.94,72.22 v43.96,72.24
  Route3 0.203: M-1.P$17 71.7,57.75 71.7,69.9 70.5,71.1 66.9,71.1 v65.4,72.6 | v14.32,20.68 14.32,20.62 12.74,19.04 12.74,17.24 v12.64,17.24
  Route14 0.203: v43.96,72.24 42.74,71.02 20.82,71.02 18.04,73.8 v18.01,73.77 | v16.16,65.82 16.16,64.48 16.1,64.42 16.1,64.4 v16.14,64.36 | v19,24 18.12,24 14.86,20.74 14.38,20.74 v14.32,20.68
  Bottom 0.203: v65.4,72.6 61.2,72.6 60.3,73.5 54.6,73.5 53.94,74.16 45.9,74.16 45.86,74.12 v45.8,74.12 | v18.01,73.77 17.05,73.77 16.16,72.88 v16.16,65.82 | v16.14,64.36 18.2,62.3 18.2,33.16 v17.54,32.5 | v12.64,17.24 13.72,16.16 CPLD.13
CPLD(10)  (via drill 0.35)
  Top 0.203: v73.3,26.8 73.3,31.12 73.34,31.16 73.34,31.82 v72.95,32.21 | v72.95,34.33 72.95,40.41 72.94,40.42 72.94,40.41 v72.99,40.36
  Route3 0.203: v25.62,14.26 26.99,15.62 33.92,15.62 34.5,16.2 v34.8,16.2 | v64.3,19.16 64.42,19.04 66.5,19.04 68.86,21.4 72.2,21.4 73.3,22.5 v73.3,26.8 | v72.95,32.21 72.95,34.27 72.92,34.3 v72.95,34.33 | v72.99,40.36 72.99,41.65 v72.96,41.67
  Route14 0.203: v34.8,16.2 35.01,16.2 35.91,15.3 36.52,15.3 38.65,15.3 39.2,15.85 48.65,15.85 51.67,18.87 63.98,18.87 64.27,19.16 v64.3,19.16 | v72.96,41.67 74.02,42.73 74.02,53.56 72.58,55 68.95,55 M-1.P$18
  Bottom 0.203: CPLD.14 18.64,16.66 20.6,14.7 25.2,14.7 25.62,14.28 v25.62,14.26
CPLD(12)  (via drill 0.35)
  Top 0.203: v15.96,41.72 15.88,41.64 15.88,40.71 14.95,39.78 14.95,28.8 15.05,28.7 v15.18,28.7
  Power1 0.203: v46,55.02 17.7,55.02 v15.96,53.28
  Route14 0.203: v15.18,28.7 15.18,22.56 13.38,20.76 v13.38,20.71
  Bottom 0.203: M-1.P$20 51,54 50,55 46,55 v46,55.02 | v15.96,53.28 v15.96,41.72 | v13.38,20.71 13.5,20.59 13.5,18.51 14.35,17.66 CPLD.16
CPLD(13)  (via drill 0.35)
  Top 0.203: v19.37,19.9 19.37,20.08 19.42,20.14 20.78,20.14 21.48,19.44 22.31,19.44 24.34,21.47 24.34,21.5 24.84,22 25.47,22 25.49,21.98 26.3,21.98 27.34,20.94 27.34,20.7 v27.38,20.66 | v30.86,27.48 31.14,27.77 31.14,28.17 32.4,29.43 32.4,33.1 33.7,34.4 v33.76,34.4 | v33.78,49.84 34.6,49.02 43.15,49.02 43.75,49.62 44.7,49.62 45.42,48.9 46.51,48.9 46.59,48.98 50.8,48.98 51.3,49.48 v51.3,49.64 | v58.92,48.24 58.92,44.14 v58.9,44.12 v58.91,44.11
  Route14 0.203: v58.91,44.11 59.84,45.04 68.99,45.04 M-1.P$27
  Bottom 0.203: CPLD.21 19.14,20.16 19.2,20.22 19.37,20.05 v19.37,19.9 | v27.38,20.66 28.74,22.02 28.74,26.97 29.13,27.36 29.16,27.36 29.4,27.6 29.97,27.6 30.03,27.54 30.7,27.54 30.72,27.52 30.82,27.52 v30.86,27.48 | v33.76,34.4 33.96,34.6 33.96,43.56 33.68,43.84 33.68,49.74 v33.78,49.84 | v51.3,49.64 53.9,49.64 54.66,48.88 58.28,48.88 v58.92,48.24
CPLD(14)  (via drill 0.35)
  Top 0.203: v27.58,21.85 27.58,21.88 28.2,22.5 28.2,27 29.64,28.44 29.64,28.47 30.6,29.43 30.6,33.04 31.7,34.14 v31.72,34.14 | v43.96,35.88 45.49,35.88 46.59,36.98 49.41,36.98 49.8,36.98 51.8,38.98 55.48,38.98 v56.7,40.2 v56.69,40.21
  Power1 0.203: v21.8,20.12 22.31,20.63 25.49,20.63 25.53,20.67 26.37,20.67 27.55,21.85 v27.58,21.85
  Route3 0.203: v56.69,40.21 56.69,45.03 58.56,46.9 67.05,46.9 M-1.P$28
  Route14 0.203: v31.72,34.14 34.48,36.9 42.6,36.9 42.68,36.98 43.78,35.88 v43.96,35.88
  Bottom 0.203: CPLD.22 19.54,20.66 20.08,20.12 v21.8,20.12
CPLD(15)  (via drill 0.35)
  Top 0.203: v17.92,21.54 18.15,21.54 20.7,24.09 20.7,40.46 25.21,44.97 v26.74,44.97 v26.74,44.98 | v51,46.18 50.98,46.18 50.18,46.98 45.16,46.98 v43.96,45.78
  Route3 0.203: v61.16,46.05 61.16,43.84 v61.2,43.8
  Route14 0.203: v26.74,44.98 31.68,44.98 32.43,44.23 34.93,44.23 35.7,45 43.2,45 43.96,45.76 v43.96,45.78 | v61.2,43.8 61.98,43.02 68.97,43.02 M-1.P$29
  Bottom 0.203: CPLD.23 17.54,21.16 v17.92,21.54 | v51,46.18 60.88,46.18 60.9,46.2 61.01,46.2 v61.16,46.05
CPLD(16)  (via drill 0.35)
  Top 0.203: v9.03,33.73 9.65,34.35 9.65,48.99 v9.54,49.1 | v53.48,48.9 v59.7,48.9 | v72.02,42.96 72,42.98 68.97,42.98 M-1.P$30
  Power1 0.203: v13.2,22.5 9.52,22.5 v9.48,22.47 | v43.96,48.9 v53.48,48.9
  Route3 0.203: v71.7,48.9 72.4,48.9 73.5,47.8 73.5,44.44 v72.02,42.96
  Route14 0.203: v43.96,48.9 43.76,49.1 v9.54,49.1
  Bottom 0.203: CPLD.24 14.04,21.66 v13.2,22.5 | v9.48,22.47 8.7,23.25 8.7,33.4 v9.03,33.73 | v59.7,48.9 59.8,49 67.46,49 67.44,48.98 70.36,48.98 70.44,48.9 v71.7,48.9
CPLD(17)  (via drill 0.35)
  Top 0.203: v19.2,76.2 20.4,77.4 29.01,77.4 29.73,76.68 40.17,76.68 40.19,76.7 69.8,76.7 69.81,76.69 71.75,76.69 72.4,77.34 v72.42,77.34
  Route3 0.203: M-1.P$31 72.13,42 74.1,43.97 74.1,53.76 72.36,55.5 72.36,71.3 71.15,72.51 v71.15,72.66 | v17.28,22.14 17.94,22.8 17.94,25.5 16.5,26.95 16.5,37.99 18.96,40.46 18.96,62.7 17.38,64.28 17.08,64.28 v17.08,64.36
  Route14 0.203: v17.08,64.36 17.08,74.08 v19.2,76.2
  Power2 0.203: v72.42,77.34 71.08,76 71.08,72.58 v71.15,72.65 v71.15,72.66
  Bottom 0.203: CPLD.25 15.85,22.19 16.71,22.19 16.72,22.2 17.34,22.2 v17.28,22.14
CPLD(18)  (via drill 0.35)
  Top 0.203: v14.4,22.8 16.2,22.8 16.8,23.4 16.8,26.58 16.69,26.69 16.69,29.94 15.62,31 15.62,39 16.41,39.78 16.68,39.78 v16.8,39.9
  Power1 0.203: v16.8,39.9 18.8,41.9 36.1,41.9 36.9,41.1 50.4,41.1 51,41.7 v51,41.76
  Bottom 0.203: CPLD.26 14.54,22.66 v14.4,22.8 | v51,41.76 51.84,42.6 64.2,42.6 64.8,42 M-1.P$32
CPLD(19)  (via drill 0.35)
  Top 0.203: v63.5,30 63.5,38 64.5,39 68.95,39 M-1.P$33
  Route3 0.203: v23.68,21.74 23.78,21.74 25.6,19.92 60.68,19.92 v63.46,22.7
  Route14 0.203: v23.68,21.74 23.64,21.7 v20.24,21.7 | v63.5,30 63.46,29.96 v63.46,22.7
  Bottom 0.203: CPLD.28 17.86,23.66 19.82,21.7 v20.24,21.7
CPLD(20)  (via drill 0.35)
  Top 0.203: v62.5,30 62.5,38 64.5,40 M-1.P$34
  Route14 0.203: v21.14,22.6 30.38,22.56 33.02,19.92 61.42,19.92 62.5,21 v62.5,30
  Bottom 0.203: CPLD.29 17.91,24.16 19.51,22.56 v21.14,22.6
CPLD(25)  (via drill 0.35)
  Top 0.203: v42.52,69 50.2,69 v50.2,68.98 | v71.64,55.94 74,53.58 v74,41.71 v74,41.7 | v73.98,40.3 73.98,34.22 v74,34.2 v74.01,34.21
  Power1 0.203: v74.01,34.21 72.78,32.98 70.93,32.98 M-1.P$41
  Route3 0.203: v74,41.7 74,40.32 v73.98,40.3
  Route14 0.203: v18.34,67.34 20,69 v42.52,69
  Bottom 0.203: CPLD.39 18.92,65.11 18.67,65.36 18.67,66.83 18.34,67.16 v18.34,67.34 | v50.2,68.98 51.7,70.48 65.2,70.48 66.66,69.02 70.36,69.02 71.12,69.02 71.64,68.5 v71.64,55.94
CPLD(26)  (via drill 0.35)
  Route14 0.203: v19,74 20.5,75.5 42,75.5 44.68,72.82 44.68,31.16 44.84,31 66.95,31 M-1.P$42
  Bottom 0.203: CPLD.40 19.42,65.08 19,65.5 v19,74
CPLD(27)
  Bottom 0.203: CPLD.41 19.92,65.15 19.34,65.73 19.34,73.34 22,76 43,76 44.66,74.34 44.66,32.18 45.84,31 68.95,31 M-1.P$43
CPLD(28)  (via drill 0.35)
  Route3 0.203: v20,66 20,73.98 22.02,76 42.5,76 44.8,73.7 44.8,32.65 46.45,31 66.95,31 M-1.P$44
  Bottom 0.203: CPLD.42 20.42,65.58 v20,66
CPLD(29)  (via drill 0.35)
  Top 0.203: v22.58,74.58 23.5,75.5 58,75.5 60.5,73 60.5,30.5 62,29 69,29 69.95,28.05 M-1.P$45
  Bottom 0.203: CPLD.43 20.92,66.58 20.5,67 20.5,72.5 v22.58,74.58
CPLD(30)  (via drill 0.35)
  Top 0.203: v20.79,73.71 20.79,75.89 21.14,76.24 v21.17,76.24 | v51.12,63.67 50.98,63.81 v50.98,72.8 | v51.14,62.36 51.98,61.52 51.98,41.74 v51.94,41.76 | v51.9,35.7 51.9,28.76 53.1,27.56 67.51,27.56 M-1.P$46
  Route3 0.203: v21.48,67.04 21.48,73.02 20.86,73.64 20.86,73.66 20.81,73.71 v20.79,73.71 | v29.88,77.46 30.07,77.27 30.07,77.23 30.49,76.81 38.99,76.81 39.3,76.5 47.28,76.5 v50.98,72.8 | v51.94,40.44 51.94,35.82 51.96,35.8 51.96,35.76 v51.9,35.7
  Bottom 0.203: CPLD.44 21.44,29.78 21.44,67 v21.48,67.04 | v21.17,76.24 22.53,77.44 22.55,77.44 29.3,77.44 29.38,77.52 29.82,77.52 v29.88,77.46 | v51.12,63.67 51.12,62.48 51.14,62.46 v51.14,62.36 | v51.94,41.76 51.92,41.74 51.96,40.54 51.94,40.52 v51.94,40.44
CPLD(31)  (via drill 0.35)
  Route3 0.203: M-1.P$47 68.91,27.04 52.54,27.04 50.5,25 46.36,25 43.24,28.12 43.24,74.18 41.92,75.5 24.5,75.5 v23.5,74.5
  Bottom 0.203: v23.5,74.5 23.44,74.44 23.44,29.78 CPLD.48
CPLD(32)
  Bottom 0.203: M-1.P$48 63.89,26 60.89,29 45.5,29 43.28,31.22 43.28,74.22 42,75.5 25.52,75.5 23.92,73.9 CPLD.49
CPLD(33)  (via drill 0.35)
  Top 0.203: v41.36,74.78 v55.22,74.78
  Route3 0.203: M-2.P$17 77.4,56 75.4,56 74.7,56.7 74.7,72.9 71.96,75.64 56.09,75.64 v55.22,74.78
  Bottom 0.203: CPLD.50 24.42,73.7 25.72,75 41.14,75 v41.36,74.78
CPLD(34)  (via drill 0.35)
  Top 0.203: v57.22,74.48 56.2,73.46 41.72,73.46 v41.46,73.72
  Bottom 0.203: CPLD.51 24.92,37.71 24.93,37.7 24.93,73.47 25.96,74.5 40.68,74.5 v41.46,73.72 | v57.22,74.48 57.44,74.26 73.24,74.26 74.74,72.76 74.74,56.1 75.84,55 M-2.P$18
CPLD(35)  (via drill 0.35)
  Top 0.203: v25.86,63.88 38.58,63.88 39.44,63.02 59.1,63.02 v59.44,62.68
  Bottom 0.203: CPLD.52 25.42,35.6 26.4,36.58 26.4,43.14 25.56,43.98 25.56,63.58 v25.86,63.88 | v59.44,62.68 59.44,59.38 63.82,55 74.32,55 75.32,54 77.4,54 M-2.P$19
CPLD(36)  (via drill 0.35)
  Top 0.203: v22.58,73.64 v22.58,73.65 21.6,74.63 21.6,75.6 21.98,75.98 73.38,75.98 74.14,76.74 v74.14,76.84
  Power1 0.203: v22.5,67.2 22.5,73.49 22.6,73.6 v22.58,73.64
  Route3 0.203: v26.69,35.89 26.57,36.01 26.57,43.75 23.44,46.88 23.44,66.26 v22.5,67.2
  Route14 0.203: v74.14,76.84 75.06,75.92 75.06,54.26 76.32,53 M-2.P$20
  Bottom 0.203: CPLD.53 25.92,35.16 26.67,35.91 v26.69,35.89
CPLD(37)  (via drill 0.35)
  Top 0.203: M-2.P$27 79.8,46.4 79.8,72.3 77.1,75 v73.8,75 | v28.46,73.84 28.42,73.8 v26.36,73.8
  Power1 0.203: v26.31,76.71 26.36,76.66 v26.36,73.8
  Route14 0.203: v28.42,62.22 28.42,62.75 28.61,62.93 28.61,63.52 28.38,63.74 v28.38,67.16 | v26.31,76.71 26.31,76.65 27.04,75.92 72.82,75.92 73.74,75 v73.8,75
  Bottom 0.203: CPLD.58 v28.42,62.22 | v28.46,73.84 28.46,67.24 v28.38,67.16
CPLD(38)  (via drill 0.35)
  Power1 0.203: v29.34,73.82 29.34,73.92 30.78,75.36 v30.78,77.52
  Route3 0.203: M-2.P$28 77.36,45.96 79.34,45.96 79.8,46.42 79.8,72.3 76.2,75.9 73.78,75.9 v73.04,76.64
  Route14 0.203: v29.32,62.55 29.26,62.61 v29.26,67.32
  Bottom 0.203: CPLD.59 28.92,61.48 29.32,61.88 v29.32,62.55 | v29.34,73.82 29.26,73.74 v29.26,67.32 | v30.78,77.52 31.8,76.5 73.04,76.5 v73.04,76.64
CPLD(39)  (via drill 0.35)
  Top 0.203: v31.53,78.07 32.92,79.46 76.76,79.46 v77.4,80.1
  Power1 0.203: v30.3,73.84 30.3,74.04 31.5,75.24 31.5,78.04 v31.53,78.07
  Route3 0.203: v30,61.8 30,62.23 30.03,62.26 30.03,67.23 30.3,67.5 30.3,67.49 v30.15,67.34 | v77.4,80.1 79.45,80.1 82.76,76.79 82.76,47.38 78.4,43.02 M-2.P$29
  Bottom 0.203: CPLD.60 29.42,61.22 v30,61.8 | v30.15,67.34 30.15,73.65 30.3,73.8 v30.3,73.84
CPLD(40)  (via drill 0.35)
  Top 0.203: M-2.P$30 76.1,43 75,44.1 75,54.98 v73.9,56.08
  Power1 0.203: v31.23,73.84 31.23,74.04 32.4,75.22 v32.4,78 v32.41,77.99 | v71.7,80.12 71.7,75.9 73.9,73.7 v73.9,72.66
  Route3 0.203: v30.46,61.04 30.92,61.5 30.92,67.21 v31.04,67.32
  Route14 0.203: v32.41,77.99 33.9,79.47 71.13,79.47 71.7,80.04 v71.7,80.12
  Bottom 0.203: CPLD.61 29.92,60.51 v30.45,61.05 v30.46,61.04 | v31.04,67.32 31.06,67.34 31.06,73.66 31.23,73.83 v31.23,73.84 | v73.9,72.66 73.9,56.18 73.9,56.17 v73.9,56.08
CPLD(41)  (via drill 0.35)
  Power1 0.203: v31.64,62.4 31.96,62.72 31.96,73.66 32.1,73.8 32.1,73.81 33.3,75.01 33.3,77.9 v33.33,77.87 | v70.8,80.23 70.8,75.9 72.95,73.75 v72.95,72.66
  Route14 0.203: v72.95,72.66 73.09,72.52 73.09,72.36 73.12,72.34 73.12,55.58 74.7,54 74.7,43.16 75.86,42 77.4,42 M-2.P$31
  Bottom 0.203: CPLD.62 30.42,59.82 31.56,60.96 31.56,62.32 v31.64,62.4 | v33.33,77.87 33.33,78.05 35.37,80.1 70.8,80.1 v70.8,80.23
CPLD(42)  (via drill 0.35)
  Top 0.203: v33.43,73.67 33.86,74.1 39.9,74.1 v39.9,73.84 | v39.9,77.34 70.04,77.34 70.06,77.32 70.08,77.32 v70.08,77.34
  Power1 0.203: v32.7,67.3 32.7,72.94 v33.43,73.67 | v39.9,73.84 v39.9,77.34 | v70.08,77.34 70.06,77.32 70.06,75.6 72.04,73.62 v72.04,72.66
  Route3 0.203: v32.7,62.4 v32.7,67.3 | v72.04,72.66 72.04,72.57 73.14,71.47 73.14,56.39 73.14,55.58 74.7,54.02 74.7,42.72 76.4,41.02 M-2.P$32
  Bottom 0.203: CPLD.63 30.92,59.72 32.7,61.5 v32.7,62.4
CPLD(43)  (via drill 0.35)
  Top 0.203: v31.58,41.1 39.36,41.1 39.44,41.02 49.41,41.02 49.49,41.1 v59.7,41.1 | v61.2,41.1 61.3,41 67.46,41 67.44,41.02 74.99,41.02 75.99,40.02 77.38,40.02 M-2.P$33
  Bottom 0.203: CPLD.66 32.42,40.18 31.5,41.1 v31.58,41.1 | v59.7,41.1 v61.2,41.1
CPLD(44)  (via drill 0.35)
  Top 0.203: v31.8,27.9 32.02,27.9 32.9,28.78 32.9,32.58 35.34,35.02 50.09,35.02 51.97,36.9 v59.7,36.9
  Bottom 0.203: CPLD.67 32.92,28.8 32.02,27.9 v31.8,27.9 | v59.7,36.9 59.7,38.67 62.05,41.02 74.48,41.02 76.4,39.1 M-2.P$34
CPLD(45)  (via drill 0.35)
  Power1 0.203: v33.12,36.64 33.46,36.98 58.42,36.98 v59.7,35.7
  Route3 0.203: v31.8,26.88 33.02,28.1 33.02,36.54 v33.12,36.64
  Bottom 0.203: CPLD.68 33.42,28.46 31.84,26.88 v31.8,26.88 | v59.7,35.7 61,37 71,37 72.02,35.98 77.41,35.98 78.39,35 M-2.P$37
CPLD(46)  (via drill 0.35)
  Top 0.203: v51.08,40.16 49.92,39 32.54,39 31.6,38.06 v31.6,36.66
  Route3 0.203: v51.08,35 51.08,40.12 51.1,40.14 v51.08,40.16 | v31.6,36.66 30.54,35.6 30.54,34.28 v31.74,33.08
  Route14 0.203: v31.74,33.08 32.96,31.86 32.96,27.86 33.46,27.36 v33.46,27.32
  Bottom 0.203: M-2.P$38 v51.08,35 | v33.46,27.32 33.92,27.78 CPLD.69
CPLD(47)  (via drill 0.35)
  Top 0.203: v26.72,32.16 29.46,34.9 29.46,40 32.66,43.2 v32.66,45
  Power1 0.203: v34.86,28.08 34.86,28.12 34.42,28.56 34.42,30.08 32.34,32.16 v26.72,32.16 | v51.04,45.06 50.98,45 v32.66,45
  Bottom 0.203: CPLD.70 34.42,28.28 34.62,28.08 v34.86,28.08 | v51.04,45.06 67.1,45.06 67.14,45.02 74.08,45.02 75.12,43.98 78.81,43.98 79.04,43.98 79.8,43.22 79.8,34.4 M-2.P$39
CPLD(48)  (via drill 0.35)
  Route3 0.203: v60.31,29.77 61.07,29 72.84,29 73.66,29.82 73.66,32.06 74.6,33 M-2.P$40
  Route14 0.203: v37.5,28.52 38,29.02 59.58,29.02 60.31,29.75 v60.31,29.77
  Bottom 0.203: CPLD.71 34.95,29.73 34.95,28.87 35.14,28.68 37.34,28.68 v37.5,28.52
CPLD(49)  (via drill 0.35)
  Power1 0.203: v61.48,31.8 61.46,31.78 v61.46,25.24
  Bottom 0.203: CPLD.76 38.46,26.16 39.3,27 43.54,27 45.56,24.98 49.41,24.98 61.46,24.98 v61.46,25.24 | M-2.P$41 77.79,31 76.81,31.98 75.2,31.98 74.2,32.98 62.66,32.98 v61.48,31.8
CPLD(50)  (via drill 0.35)
  Power1 0.203: v51.24,32.4 50.45,32.4 49.97,32.88 45.78,32.88 45,32.1 45,26.4 v43.92,25.32
  Route14 0.203: M-2.P$42 76.4,31.06 74.53,32.93 51.83,32.93 51.3,32.4 v51.24,32.4
  Bottom 0.203: v43.92,25.32 43.58,24.98 39.06,24.98 38.41,25.63 37.55,25.63 CPLD.77
CPLD(51)  (via drill 0.35)
  Top 0.203: v76.2,73.2 75.36,74.04 62.18,74.04 v61.66,73.52 | v51.92,72.8 51.92,64 v52.24,63.68 v52.24,63.67 | v52.22,62.36 52.82,61.76 v52.82,41.76 | v52.8,35.66 52.56,35.42 v52.56,29.74
  Power1 0.203: v52.56,29.74 52.56,26.04 v52.52,26 v52.51,26.01
  Route3 0.203: v52.84,40.42 52.84,35.7 v52.8,35.66 | v52.54,21.64 52.54,21.76 51.8,22.5 36.9,22.5 34.16,25.24 33.22,25.24 32.43,26.03 v32.32,25.92
  Route14 0.203: M-2.P$43 79.74,30.34 79.74,72.36 78.9,73.2 v76.2,73.2 | v61.66,73.52 52.48,73.52 51.9,72.94 51.9,72.82 v51.92,72.8 | v52.51,26.01 52.55,21.65 v52.54,21.64
  Bottom 0.203: v52.24,63.67 52.24,62.38 v52.22,62.36 | v52.84,40.42 52.82,40.44 v52.82,41.76 | v32.32,25.92 33.08,25.16 CPLD.78
CPLD(52)  (via drill 0.35)
  Top 0.203: M-2.P$44 76.4,29.02 75,30.42 75,31.5 73.5,33 67.06,33 v66.4,33.66
  Power1 0.203: v26.68,34.86 32.46,34.86 32.72,35.12 49.59,35.12 v51.14,33.57 v51.14,33.56
  Route14 0.203: v31.45,25.71 29.4,27.76 29.4,33.9 28.46,34.84 26.7,34.84 v26.68,34.86
  Bottom 0.203: CPLD.79 32.48,24.66 v31.44,25.7 v31.45,25.71 | v51.14,33.56 66.3,33.56 v66.4,33.66
CPLD(53)  (via drill 0.35)
  Top 0.203: M-2.P$45 77.4,26 72.32,26 71.28,27.04 70.38,27.04 70.36,27.02 54.64,27.02 v53.58,25.96 v53.57,25.97
  Power1 0.203: v37.5,32.32 35.6,30.42 35.6,25.92 34.68,25 30.82,25 v30.4,25.42
  Route14 0.203: v53.57,25.97 52.5,27.04 37.7,27.04 36.46,28.28 36.46,31.26 37.5,32.3 v37.5,32.32
  Bottom 0.203: v30.4,25.42 31.66,24.16 CPLD.80
CPLD(54)  (via drill 0.35)
  Top 0.203: v61.5,22.5 62,22 64.9,22 v65.1,22.2
  Route14 0.203: v65.1,22.2 65.1,27.6 66.6,29.1 72.3,29.1 74.4,27 M-2.P$46
  Bottom 0.203: CPLD.81 38.44,23.66 39.76,22.34 61.34,22.34 v61.5,22.5
CPLD(55)  (via drill 0.35)
  Top 0.203: v33.66,17.7 34.16,18.2 35.77,18.2 36.58,17.38 50.87,17.38 53.22,15.04 54.25,15.04 54.25,15.07 55.63,16.45 63.95,16.45 65.4,17.9 65.4,18.3 v65.34,18.3
  Route14 0.203: v71.24,20.12 71.9,19.46 77.66,19.46 79.38,21.18 79.38,24.12 78.5,25 M-2.P$47
  Bottom 0.203: CPLD.83 37.49,22.63 36.3,22.63 33.66,19.99 v33.66,17.7 | v65.34,18.3 66.24,17.4 68.52,17.4 v71.24,20.12
CPLD(56)  (via drill 0.35)
  Top 0.203: v34.62,17.54 34.64,17.56 35.94,17.56 36.45,17.05 50.43,17.05 v52.85,14.48
  Route3 0.203: v52.85,14.48 54.12,13.36 55.26,13.36 57.81,15.92 64.34,15.92 66.19,14.07 72.39,14.07 74.09,15.77 74.09,23.65 75.44,25 M-2.P$48
  Bottom 0.203: CPLD.84 37.49,22.13 36.27,22.13 34.62,20.49 v34.62,17.54
CPLD(57)  (via drill 0.35)
  Top 0.203: v51.73,14.48 51.61,14.48 49.37,16.72 35.8,16.72 v35.62,16.9
  Route14 0.203: RAB.P$17 85.9,57 84.5,57 83,55.5 83,14.15 81.85,13 53.11,13 51.64,14.47 v51.73,14.48
  Bottom 0.203: CPLD.85 37.49,21.63 36.23,21.63 35.62,21.02 v35.62,16.9
CPLD(58)  (via drill 0.35)
  Power1 0.203: v45,21.6 45,20.04 v50.56,14.48
  Route14 0.152: 81.88,12.57 81.88,12.56
  Route14 0.203: v50.56,14.48 52.6,12.77 52.8,12.57 81.88,12.57 | 81.88,12.56 83.41,14.09 83.41,54.91 84.5,56 RAB.P$18
  Bottom 0.203: v45,21.6 44.88,21.48 39.64,21.48 39.32,21.16 CPLD.86
CPLD(59)  (via drill 0.35)
  Top 0.203: v49.55,14.48 49.54,14.52 50.56,13.5 57.46,13.5 58.4,14.44 v58.44,14.4
  Route3 0.203: v58.44,14.4 59.61,15.57 64.2,15.57 66.03,13.74 79.74,13.74 81.51,15.51 81.51,44.98 83.5,46.97 83.5,52 84.5,53 86,53 86.9,53.9 RAB.P$19
  Bottom 0.203: CPLD.87 39.28,20.66 40.78,19.16 44.88,19.16 v49.55,14.48
CPLD(60)  (via drill 0.35)
  Top 0.203: v74.96,14.84 74.62,15.18 72.39,15.18 v72.32,15.11
  Route3 0.203: v48.54,14.48 50,13 55.92,13 57.32,14.4 v57.42,14.4 | RAB.P$20 83.1,52.2 83.1,47.1 81.18,45.18 81.18,15.65 79.63,14.1 75.58,14.1 74.84,14.84 v74.96,14.84
  Route14 0.203: v72.32,15.11 70.71,13.5 58.32,13.5 v57.42,14.4
  Bottom 0.203: CPLD.88 39.3,20.16 40.63,18.83 44.22,18.83 44.22,18.82 48.54,14.5 v48.54,14.48
CPLD(61)  (via drill 0.35)
  Top 0.203: v45.66,14.48 45.66,12.87 46.31,12.22 59.4,12.22 v61.5,14.38
  Route3 0.203: RAB.P$27 85.9,47 84,47 81.84,44.84 81.84,15.34 79.9,13.4 65.86,13.4 64.07,15.19 62.31,15.19 v61.5,14.38
  Bottom 0.203: CPLD.93 42.64,17.66 45.66,14.64 v45.66,14.48
CPLD(62)  (via drill 0.35)
  Top 0.203: v44.62,14.48 44.62,12.88 45.62,11.88 60.14,11.88 v62.56,14.4
  Route3 0.203: v62.56,14.4 62.56,14.36 63.88,13.04 80.04,13.04 82.18,15.18 82.18,44.44 83.74,46 RAB.P$28
  Bottom 0.203: CPLD.94 41.96,17.16 v44.62,14.48
CPLD(63)  (via drill 0.35)
  Route3 0.203: v43.66,14.48 43.66,13.5 44.51,12.65 80.15,12.65 82.54,15.04 82.54,43.52 84.02,45 86,45 86.9,44.1 RAB.P$29
  Bottom 0.203: CPLD.95 41.54,16.66 43.66,14.52 v43.66,14.48
CPLD(64)  (via drill 0.35)
  Route3 0.203: v42.74,14.48 42.74,13.48 43.9,12.32 80.32,12.32 82.88,14.88 82.88,42.74 84.14,44 RAB.P$30
  Bottom 0.203: CPLD.96 41.06,16.16 v42.74,14.48
CPLD(65)  (via drill 0.35)
  Route3 0.203: v41.74,14.48 41.74,13.54 43.3,11.98 80.48,11.98 83.24,14.74 83.24,40 84.24,41 85.9,41 RAB.P$31
  Bottom 0.203: v41.74,14.48 40.64,15.64 40.62,15.66 CPLD.97
CPLD(66)  (via drill 0.35)
  Top 0.203: v40.8,14.48 43.68,11.54 60.8,11.54 v63.56,14.38
  Bottom 0.203: CPLD.98 40.06,15.16 v40.8,14.48 | v63.56,14.38 63.8,14.06 80.06,14.06 81.64,15.64 81.64,41.14 82.5,42 RAB.P$32
CPLD(67)  (via drill 0.35)
  Route3 0.203: v39.72,14.48 39.72,14.44 42.52,11.64 80.71,11.64 83.6,14.53 83.6,38.08 84.54,39.02 85.92,39.02 RAB.P$33
  Bottom 0.203: CPLD.100 39.4,14.16 v39.72,14.48
CPLD(68)
  Bottom 0.203: CPLD.101 80.66,13.66 81.98,14.98 81.98,38.48 83.5,40 RAB.P$34
CPLD(69)
  Bottom 0.203: RAB.P$37 85.9,37 83.5,37 82.32,35.82 82.32,14.26 81.2,13.14 39,13.14 39.01,13.13 37.55,13.13 CPLD.102
CPLD(70)
  Bottom 0.203: CPLD.103 81.19,12.66 82.66,14.13 82.66,35.3 83.36,36 RAB.P$38
CPLD(71)
  Bottom 0.203: CPLD.104 81.16,12.16 83,14 83,34.5 83.5,35 85.9,35 RAB.P$39
CPLD(72)
  Bottom 0.203: CPLD.105 81.16,11.66 83.34,13.84 83.34,32.84 84.5,34 RAB.P$40
CPLD(73)  (via drill 0.35)
  Top 0.203: RAB.P$41 86.5,32 85.5,33 83.7,33 83.4,33.3 83.4,74.1 79.5,78 38.4,78 v38.1,77.7 | v38.13,33.45 38.39,33.19 38.39,23.39 32.98,17.98 32.98,17.22 35.91,13.67 35.91,13.65 v36.03,13.53
  Power1 0.203: v38.1,77.7 v38.1,66.52
  Route3 0.203: v38.1,66.52 38.1,62.58 v38.09,62.57 v38.08,62.57
  Bottom 0.203: v38.08,62.57 38.08,62.07 37.58,61.57 37.58,34 v38.13,33.45 | v36.03,13.53 35.39,13.53 34.39,12.53 34.39,11.31 34.39,8.09 CPLD.111
CPLD(74)  (via drill 0.35)
  Top 0.203: RAB.P$42 84.1,32 82.8,33.3 82.8,73.8 79.5,77.1 v79.5,77.04 | v80.16,78.34 80.12,78.38 37.82,78.38 37.17,77.73 v37.05,77.85 | v37.08,33.46 36.84,33.22 36.84,22.38 32.4,17.94 32.4,16.44 34.64,14.2 v34.64,14.16
  Power1 0.203: v37.05,77.85 v37.05,66.6
  Route3 0.203: v37.05,66.6 v37.05,62.55 v37.06,62.54
  Bottom 0.203: v80.16,78.34 80.16,77.7 v79.5,77.04 | v37.06,62.54 37.08,62.52 v37.08,33.46 | v34.64,14.16 33.92,13.44 CPLD.112
CPLD(75)  (via drill 0.35)
  Top 0.203: RAB.P$43 85.9,31 84.32,31 82.2,33.12 82.2,73.2 78.44,76.96 v78.44,77 | v78.41,79.13 37.39,79.13 v36.12,77.86 v36.11,77.87 | v36.12,33.08 36.12,22.36 31.9,18.14 31.9,16.06 33.67,14.29 v33.67,14.11
  Power1 0.203: v36.11,77.87 v36.11,66.59 v36.1,66.58
  Route3 0.203: v36.1,66.58 36.1,62.5 v36.12,62.48
  Bottom 0.203: v78.44,77 78.44,79.12 v78.42,79.14 v78.41,79.13 | v36.12,62.48 v36.12,33.08 | v33.67,14.11 33.42,13.87 CPLD.113
CPLD(76)  (via drill 0.35)
  Top 0.203: v32.74,14.16 31.5,15.4 31.5,18.28 35.58,22.36 35.58,32.58 v35.18,32.98 | RAB.P$44 84.55,30 81.87,32.68 81.87,72.63 77.4,77.1 v77.4,77.04
  Power1 0.203: v35.17,77.91 v35.17,67.09 v35.16,67.08
  Route3 0.203: v35.18,62.56 35.18,67.06 v35.16,67.08
  Bottom 0.203: CPLD.114 32.92,13.98 v32.74,14.16 | v35.18,32.98 35.18,62.52 35.2,62.54 v35.18,62.56 | v77.4,77.04 77.4,78.6 76.8,79.2 36.48,79.2 v35.18,77.9 v35.17,77.91
CPLD(77)  (via drill 0.35)
  Top 0.203: RAB.P$45 86.29,28 85.27,29.02 84.49,29.02 83.74,29.77 83.74,29.8 81.52,32.02 81.52,71.78 v76.5,76.8 | v32.24,12.96 32.27,12.98 32.27,13.69 31.17,14.78 31.17,19.26 34.18,22.27 v34.18,32.92
  Power1 0.203: v34.2,78 v34.2,66.9
  Route3 0.203: v34.2,66.9 v34.2,62.57
  Route14 0.203: v33.3,6.73 35.57,9 40.5,9 40.71,8.79 46.92,8.79 v48.75,10.62 | v76.5,76.8 76.5,78.26 75.62,79.14 35.34,79.14 v34.2,78
  Bottom 0.203: v33.3,6.73 v33.29,6.72 32.9,6.72 32.45,7.17 32.45,8.03 CPLD.115 32.39,8.09 32.39,12.81 v32.24,12.96 | v34.2,62.57 34.58,62.19 34.58,33.32 v34.18,32.92
CPLD(78)  (via drill 0.35)
  Top 0.203: v31.18,4.96 31.22,5 33.26,5 36.26,8 53.7,8 56.18,10.48 v56.18,10.64 v56.19,10.65 | v66.02,20.16 66.02,17.46 64.28,15.72 v56.14,15.72 | RAB.P$46 83.02,26.12 83.02,21 81.82,19.8 78.9,19.8 v77.7,21
  Power1 0.203: v56.14,15.72 56.1,10.74 v56.19,10.65
  Bottom 0.203: CPLD.116 31.92,5.82 31.18,5.08 v31.18,4.96 | v66.02,20.16 66.02,20.3 66.72,21 v77.7,21
CPLD(79)  (via drill 0.35)
  Top 0.203: RAB.P$47 85.9,25 84.5,25 83.68,24.18 83.68,22.92 v84.5,22.1 | v46.38,9.5 32.9,9.5 v30,6.6
  Bottom 0.203: v46.38,9.5 79.5,9.5 83.68,13.68 83.68,21.28 v84.5,22.1 | v30,6.6 29.92,6.68 CPLD.120
CPLD(80)  (via drill 0.35)
  Top 0.203: RAB.P$48 83.35,24.45 83.35,22.31 84.48,21.18 v84.48,21.16
  Route14 0.203: v84.48,21.16 84.48,14.48 82.15,12.15 36.49,12.15 35.38,11.04 30.9,11.04 29.72,9.86 v29.72,9.7
  Bottom 0.203: v29.72,9.7 29.44,9.42 29.44,8.08 CPLD.121
CPLD(81)  (via drill 0.35)
  Top 0.203: P_18.1 65.89,16.63 64.32,15.06 55.94,15.06 v55.22,14.34
  Power1 0.203: v55.22,14.34 55.28,14.28 v55.31,10.66
  Route3 0.203: v30.65,2.15 31.21,2.17 35.7,6.66 35.7,7.42 36.28,8 48.28,8 51.58,11.3 54.67,11.3 v55.31,10.66
  Bottom 0.203: CPLD.122 28.92,3.88 v30.65,2.15
CPLD(82)  (via drill 0.35)
  Top 0.203: v58.02,8.82 58.7,9.5 59.65,9.5 66.28,16.13 P_18.2
  Route3 0.203: v29.52,2.28 30.47,1.33 30.86,1.33 34.68,5.15 57.35,5.15 58.04,5.84 58.04,8.8 v58.02,8.82
  Bottom 0.203: CPLD.123 28.42,3.4 29.52,2.31 v29.52,2.28
CPLD(83)  (via drill 0.35)
  Top 0.203: P_18.3 66.4,15.63 59.7,8.93 59.7,8.16 v59.64,8.1
  Power1 0.203: v59.64,8.1 59.68,8.06 v61.7,8.06
  Route14 0.203: v61.7,8.06 60.64,8.06 60.6,8.1 60.24,7.74 60.24,5.58 59.81,5.15 34.71,5.15 34.7,5.16 34.69,5.15 34.68,5.15 30.86,1.33 29.42,1.33 v28.45,2.3 v28.44,2.3
  Bottom 0.203: v28.44,2.3 28.44,2.32 27.92,2.84 CPLD.124
CPLD(84)  (via drill 0.35)
  Top 0.203: P_18.4 66.44,15.13 60.3,8.99 60.3,7.17 60.75,6.72 60.78,6.72 v61.34,6.16
  Bottom 0.203: CPLD.125 27.42,2.37 28.44,1.35 30.88,1.35 34.68,5.15 60.35,5.15 61.34,6.14 v61.34,6.16
CPLD(85)  (via drill 0.35)
  Top 0.203: P_18.11 69.37,11.63 70.14,10.86 v70.14,10.23 | v63.95,1.15 62.43,1.15 61.42,2.15 61.42,4.28 60.88,4.82 44.28,4.82 44.26,4.8 40.68,4.8 40.66,4.82 34.82,4.82 31,1 26.84,1 25.43,2.41 v25.38,2.36
  Route3 0.203: v70.14,10.23 70.14,7.54 63.95,1.35 v63.95,1.15
  Bottom 0.203: v25.38,2.36 25.38,2.4 24.92,2.86 CPLD.130
CPLD(86)  (via drill 0.35)
  Top 0.203: v63.9,4.5 v63.9,8.24 63.91,8.23 v63.9,8.23 | v62.64,10.32 62.66,10.3 63.49,11.13 P_18.12
  Power1 0.203: v63.9,8.23 62.66,9.5 v62.64,10.32
  Route3 0.203: v63.9,4.5 63.9,2.1 62.94,1.14 v61.49,1.14
  Bottom 0.203: CPLD.131 24.42,2.34 25.74,1.02 31.02,1.02 34.82,4.82 60.88,4.82 61.42,4.28 61.42,1.21 v61.49,1.14
CPLD(87)  (via drill 0.35)
  Top 0.203: v63.1,4.88 63.24,5.02 63.24,8.58 65.31,10.65 68.3,10.65 P_18.13
  Route3 0.203: v63.1,4.88 62.58,4.36 v62.58,1.94
  Route14 0.203: v24.08,1.76 24.84,1 31,1 34.82,4.82 60.88,4.82 62.58,3.12 v62.58,1.94
  Bottom 0.203: CPLD.132 23.92,1.9 24.06,1.76 v24.08,1.76
CPLD(88)  (via drill 0.35)
  Top 0.203: P_18.23 73.27,5.59 75.16,4.34 v75.16,3.92
  Route3 0.203: v61.06,7.34 58.54,4.82 34.82,4.82 31,1 v23.5,1
  Bottom 0.203: v75.16,3.92 74.95,4.12 65.25,4.12 62.04,7.34 v61.06,7.34 | v23.5,1 23.42,1.08 CPLD.133
CPLD(89)  (via drill 0.35)
  Top 0.203: v76.06,3.94 76.06,4.41 73.77,5.92 P_18.24 | v69.5,2 65,2 61.85,5.15 34.67,5.15 32.54,3.02 24.02,3.02 22.5,1.5 v22.5,1.03
  Route14 0.203: v76.06,3.94 v76.07,3.93 76.07,3.56 74.5,2 v69.5,2
  Bottom 0.203: CPLD.134 22.92,1.35 22.6,1.03 v22.5,1.03
CPLD(90)  (via drill 0.35)
  Top 0.203: v21.6,6.24 19,8.84 19,11 19.75,11.75 19.75,15.5 16.62,18.62 16.62,21.86 16.62,22.75 16.94,23.06 16.94,23.07 17.91,24.04 17.91,26.8 18.06,26.94 18.06,28.47 18,28.53 18,31.11 16.88,32.24 16.88,33.5 20.12,36.75 20.12,47.62 22.65,50.15 v22.65,50.19
  Power1 0.203: v22.66,62.56 23.03,62.56 23.75,63.28 23.75,64.5 22.5,65.75 v22.5,65.88 23.38,66.76 23.38,69.12 24.25,70 24.25,79.5 23.62,80.12 23.62,83.86 C_-Z.6
  Bottom 0.203: CPLD.135 22.42,7.06 v21.6,6.24 | v22.65,50.19 22.65,62.28 22.88,62.5 22.72,62.5 v22.66,62.56
CPLD(91)  (via drill 0.35)
  Top 0.203: v66.18,7.14 68.04,7.14 68.1,7.2 v68.14,7.16 | v76.74,5.72 76.34,5.72 75.77,6.29 P_18.28
  Route3 0.203: v58.96,8.72 59.76,9.52 65.72,9.52 66.2,9.04 66.2,7.16 v66.18,7.14
  Route14 0.203: v21.59,2.41 22.49,2.41 22.5,2.4 23.45,3.35 32.42,3.35 34.56,5.49 34.84,5.49 34.85,5.48 57.6,5.48 58.06,5.94 58.06,7.8 58.96,8.7 v58.96,8.72 | v68.14,7.16 68.22,7.16 68.72,6.66 75.8,6.66 v76.74,5.72
  Bottom 0.203: CPLD.138 20.92,3.08 v21.59,2.41
CPLD(92)  (via drill 0.35)
  Top 0.203: v20.97,1.77 20.4,2.34 20.4,3.3 21.32,4.22 v32.04,4.22 v32.04,4.23 | v77.86,3.28 77.86,3.78 77.76,3.88 P_18.32
  Route14 0.203: v61.08,8.8 61.38,9.1 65.04,9.1 v65.38,8.76 | v70.66,5.27 71.16,4.77 76.39,4.77 77.86,3.3 v77.86,3.28
  Bottom 0.203: CPLD.139 20.42,2.32 v20.97,1.77 | v32.04,4.23 32.1,4.29 33.36,4.29 34.59,5.52 59.72,5.52 60.3,6.1 60.3,8.08 61.05,8.83 v61.08,8.8 | v65.38,8.76 65.38,6.14 66.46,5.06 70.46,5.06 v70.66,5.26 v70.66,5.27
CPLD(93)  (via drill 0.35)
  Top 0.203: v72.24,16.42 71.62,15.8 71.62,11.34 71.6,11.32 73.29,9.63 P_18.34
  Route3 0.203: v20.42,1.04 19.9,1.56 19.9,2.52 20.98,3.6 21.6,3.6 v21.6,3.56
  Route14 0.203: v21.6,3.56 22.46,4.42 22.46,9.86 24.02,11.42 35.24,11.42 39.34,15.52 54.71,15.52 55.69,16.5 56.39,16.5 63,16.5 65.67,13.83 69.65,13.83 v72.24,16.42
  Bottom 0.203: CPLD.140 19.92,1.54 v20.42,1.04
CPLD(94)  (via drill 0.35)
  Top 0.203: v20.1,9.56 25.64,9.56 26.58,10.5 32.39,10.5 33.06,9.83 45.68,9.83 46.05,10.2 47.5,10.2 48.22,9.48 52.98,9.48 v53.62,8.84 | v76.8,10.29 76.96,10.13 P_18.35
  Route3 0.203: v55.45,8.83 57.94,11.31 62.73,11.31 v63.67,10.37
  Route14 0.203: v63.67,10.37 64.33,11.03 68.53,11.03 68.56,11 70.41,11 71.05,10.36 v71.05,10.26
  Bottom 0.203: CPLD.141 19.42,9.22 19.8,9.6 20.1,9.6 v20.1,9.56 | v53.62,8.84 55.3,8.84 55.32,8.82 v55.45,8.82 v55.45,8.83 | v71.05,10.26 72.12,11.33 75.75,11.33 v76.8,10.28 v76.8,10.29
CPLD(95)  (via drill 0.35)
  Top 0.203: v19.18,1.8 19.18,2.98 21.6,5.4 v26.1,5.4 | v73.14,15.85 74.87,15.85 76.6,14.13 P_18.43
  Power1 0.203: v54.04,10.54 54.02,10.54 54.02,14.28 v54.08,14.34
  Route3 0.203: v26.1,5.4 26.7,6 28.2,6 28.2,6.94 29.66,8.4 47.57,8.4 v49.76,10.59
  Bottom 0.203: CPLD.142 18.92,2.06 v19.18,1.8 | v54.04,10.54 53.99,10.59 v49.76,10.59 | v54.08,14.34 54.8,15.06 60.04,15.06 60.4,15.42 71.61,15.42 71.95,15.76 73.14,15.76 v73.14,15.85
CPLD(96)  (via drill 0.35)
  Top 0.203: v76.88,14.84 77.09,14.63 P_18.44
  Power1 0.203: v77.48,10.88 76.88,11.48 v76.88,14.84
  Route3 0.203: v18.59,0.99 18.42,1.16 18.42,2.22 20.72,4.52 27.62,4.52 28.97,5.87 32.69,5.87 v32.73,5.83 | v67.02,6.32 67.02,9.63 68.7,11.31 77.05,11.31 v77.48,10.88
  Route14 0.203: v32.73,5.83 v32.73,5.84 34.86,5.84 35.7,6.68 35.7,7.44 36.24,7.98 55.62,7.98 57.19,9.55 61.38,9.55 61.39,9.54 66.28,9.54 67.04,8.78 67.04,6.34 v67.02,6.32
  Bottom 0.203: CPLD.143 18.42,1.2 18.63,0.99 v18.59,0.99
CPLD(A)  (via drill 0.35)
  Top 0.203: P_18.47 79.7,16.11 78.83,16.11 78.32,15.6 78.3,15.6 v78,15.3 | v47.8,10.8 43.92,10.8 41.86,12.86 35.66,12.86 v35.16,12.36 | v29.99,13.79 27.01,13.79 v26.88,13.92
  Power1 0.203: v78,15.3 78.3,15 78.3,11 78.38,10.92 v78.38,10.88
  Route3 0.203: v14.52,18.42 14.78,18.16 18.4,18.16 v18.4,18.18
  Route14 0.203: v78.38,10.88 78.19,11.07 78.19,11.17 77.54,11.81 48.52,11.81 47.8,11.1 v47.8,10.8 | v35.16,12.36 34.8,12 31.8,12 v30,13.8 v29.99,13.79
  Bottom 0.203: CPLD.17 14.78,18.16 v14.52,18.42 | v18.4,18.18 22.62,18.18 v26.88,13.92
CPLD(B)  (via drill 0.35)
  Top 0.203: v44.24,20.76 45.43,19.57 54.43,19.57 56.34,17.66 56.34,17.65 v56.33,17.64 | v78.41,17.2 78.98,16.63 P_18.48
  Power1 0.203: v28.72,17.34 28.76,17.3 29.05,17.3 29.05,17.29 32.17,17.29 37.08,22.2 42.78,22.2 44.22,20.76 v44.24,20.76 | v56.33,17.64 58.01,15.96 68.57,15.96 70.61,18 77.6,18 v78.4,17.2 v78.41,17.2
  Route14 0.203: v19.28,19 20.04,18.24 27.82,18.24 v28.72,17.34
  Bottom 0.203: CPLD.20 18.64,19.66 19.28,19.02 v19.28,19
CPLD(C)  (via drill 0.35)
  Top 0.203: P_18.49 77.75,18.6 77.75,20 76.05,21.7 v65.98,21.7
  Route3 0.203: v19.95,28.42 21.98,26.39 21.98,21.02 23.81,19.19 63.17,19.19 65.68,21.7 v65.98,21.7
  Bottom 0.203: CPLD.38 18.42,29.1 18.45,29.07 18.45,28.87 18.9,28.42 v19.95,28.42
CPLD(D)  (via drill 0.35)
  Top 0.203: v62.46,19.92 63.54,21 76.28,21 77.27,20.01 P_18.50
  Route14 0.203: v62.46,19.92 62.08,19.54 24.92,19.54 v24.56,19.9
  Bottom 0.203: CPLD.45 21.92,22.54 v24.56,19.9
CPLD(E)  (via drill 0.35)
  Top 0.203: P_18.51 76.75,18.6 76.75,19.47 76,20.22 v76.02,20.24 | v22.96,18.96 22.96,19.34 24.96,21.34 v25.2,21.34
  Route14 0.203: v76.02,20.24 76.02,20.58 75.55,21.05 66.33,21.05 66.27,20.99 64.93,20.99 63.14,19.2 30.32,19.2 29.9,18.78 23.16,18.78 22.98,18.96 v22.96,18.96
  Bottom 0.203: v25.2,21.34 26.42,22.56 CPLD.54
CPLD(F)  (via drill 0.35)
  Top 0.203: P_18.52 76.29,18.56 76.29,17.69 76.48,17.5 76.96,17.5 v77.58,16.88
  Power1 0.203: v77.58,16.88 77.98,16.48 86.38,16.48 v86.7,16.8 | v27.22,67.24 27.22,76.7 27.24,76.72 v27.22,76.74
  Route3 0.203: v75.14,77.04 73.4,78.78 28.86,78.78 27.22,77.14 v27.22,76.74
  Route14 0.203: v83.48,75.78 76.48,75.78 75.12,77.14 75.12,77.06 v75.14,77.04 | v27.44,62.22 27.44,62.69 27.19,62.93 27.19,63.52 27.22,63.54 v27.22,67.24
  Bottom 0.203: v86.7,16.8 91.18,21.28 91.18,72.36 87.76,75.78 v83.48,75.78 | CPLD.56 27.42,62.2 v27.44,62.22
CPLD(G)  (via drill 0.35)
  Top 0.203: P_18.53 75.79,18.56 75.79,17.69 76.96,16.52 76.96,15.82 v76.98,15.8 | v54.45,18.03 53.29,19.2 44.7,19.2 43.2,20.7 v43.23,20.73
  Route14 0.203: v76.98,15.8 76.98,16.48 75.3,18.16 66.64,18.16 66.64,18.2 v66.68,18.23 | v43.23,20.73 43.09,20.88 43.09,20.95 42.12,21.91 37.2,21.91 35.7,23.41 35.7,31.5 35.1,32.1 v34.92,32.1
  Bottom 0.203: v66.68,18.23 65.95,18.96 65.07,18.96 64.47,18.35 54.79,18.35 54.38,17.94 54.38,17.96 v54.45,18.03 | v34.92,32.1 35.42,31.6 CPLD.72
CPLD(H)  (via drill 0.35)
  Top 0.203: v47.56,14.48 49.03,13 57.97,13 59.37,14.4 v59.5,14.4 | v75.46,16.28 75.46,17.53 75.25,17.73 75.27,17.75 P_18.54
  Power1 0.203: v59.5,14.4 60.58,15.5 63.87,15.5 65.64,13.73 72.85,13.73 75.4,16.28 v75.46,16.28
  Bottom 0.203: CPLD.89 37.55,19.63 39.35,19.63 40.48,18.5 43.6,18.5 47.6,14.5 v47.56,14.48
CPLD(I)  (via drill 0.35)
  Top 0.203: v46.62,14.48 48.54,12.58 53,12.58 | 53,12.58 58.72,12.58 v60.52,14.36 | P_18.55 74.77,17.21 v74.8,17.18 | 53,12.58
  Bottom 0.203: CPLD.92 42.96,18.16 v46.62,14.48 | v60.52,14.36 61.2,15.06 65.44,15.06 66.07,14.43 72.79,14.43 74.8,16.44 v74.8,17.18
CPLD(J)  (via drill 0.35)
  Top 0.203: v56.84,8.2 56.84,9.22 58.32,10.7 59.67,10.7 v59.78,10.59 | v73.36,16.72 73.27,16.8 P_18.58
  Power1 0.203: v59.78,10.59 60.33,11.14 65.26,11.14 68,8.4 v68.1,8.4 | v73.5,10.59 76.12,13.21 76.12,15.56 v76.1,15.56
  Route3 0.203: v68.1,8.4 69.43,9.73 69.43,10.52 69.89,10.98 73.2,10.98 73.5,10.68 v73.5,10.59
  Bottom 0.203: CPLD.110 34.95,8.09 34.95,8.95 35.48,9.48 39.89,9.48 40.57,8.8 52.73,8.8 53.36,8.17 55.73,8.17 55.73,8.18 56.83,8.18 v56.84,8.2 | v76.1,15.56 76.1,16 76.11,16.01 76.11,17.29 75.56,17.84 74.46,17.84 73.66,17.04 73.64,17.04 73.36,16.76 v73.36,16.72
CPLD(K)  (via drill 0.35)
  Top 0.203: v30.63,14.4 30.63,19.79 v32.44,21.6 v32.43,21.61 | v72.22,20.18 72.78,19.62 P_18.59
  Route3 0.203: v31.62,9.72 31.54,9.8 31.54,13.5 v30.64,14.4 v30.63,14.4 | v32.43,21.61 33.28,20.76 v40.14,20.76
  Bottom 0.203: CPLD.117 31.42,9.52 v31.62,9.72 | v40.14,20.76 41.41,19.49 45.02,19.49 47.57,16.94 68.98,16.94 v72.22,20.18
CPLD(L)  (via drill 0.35)